# EasyEDA Pro project ProProject_工科大_2023-10-10.epro

# Schematic power
Create Date: 2023-09-30; Page Name: P1; Project Name: 工科大; Schematic Name: power; Update Date: 2023-10-10; Company: 嘉立创EDA; Page Size: A4; Version: V1.0
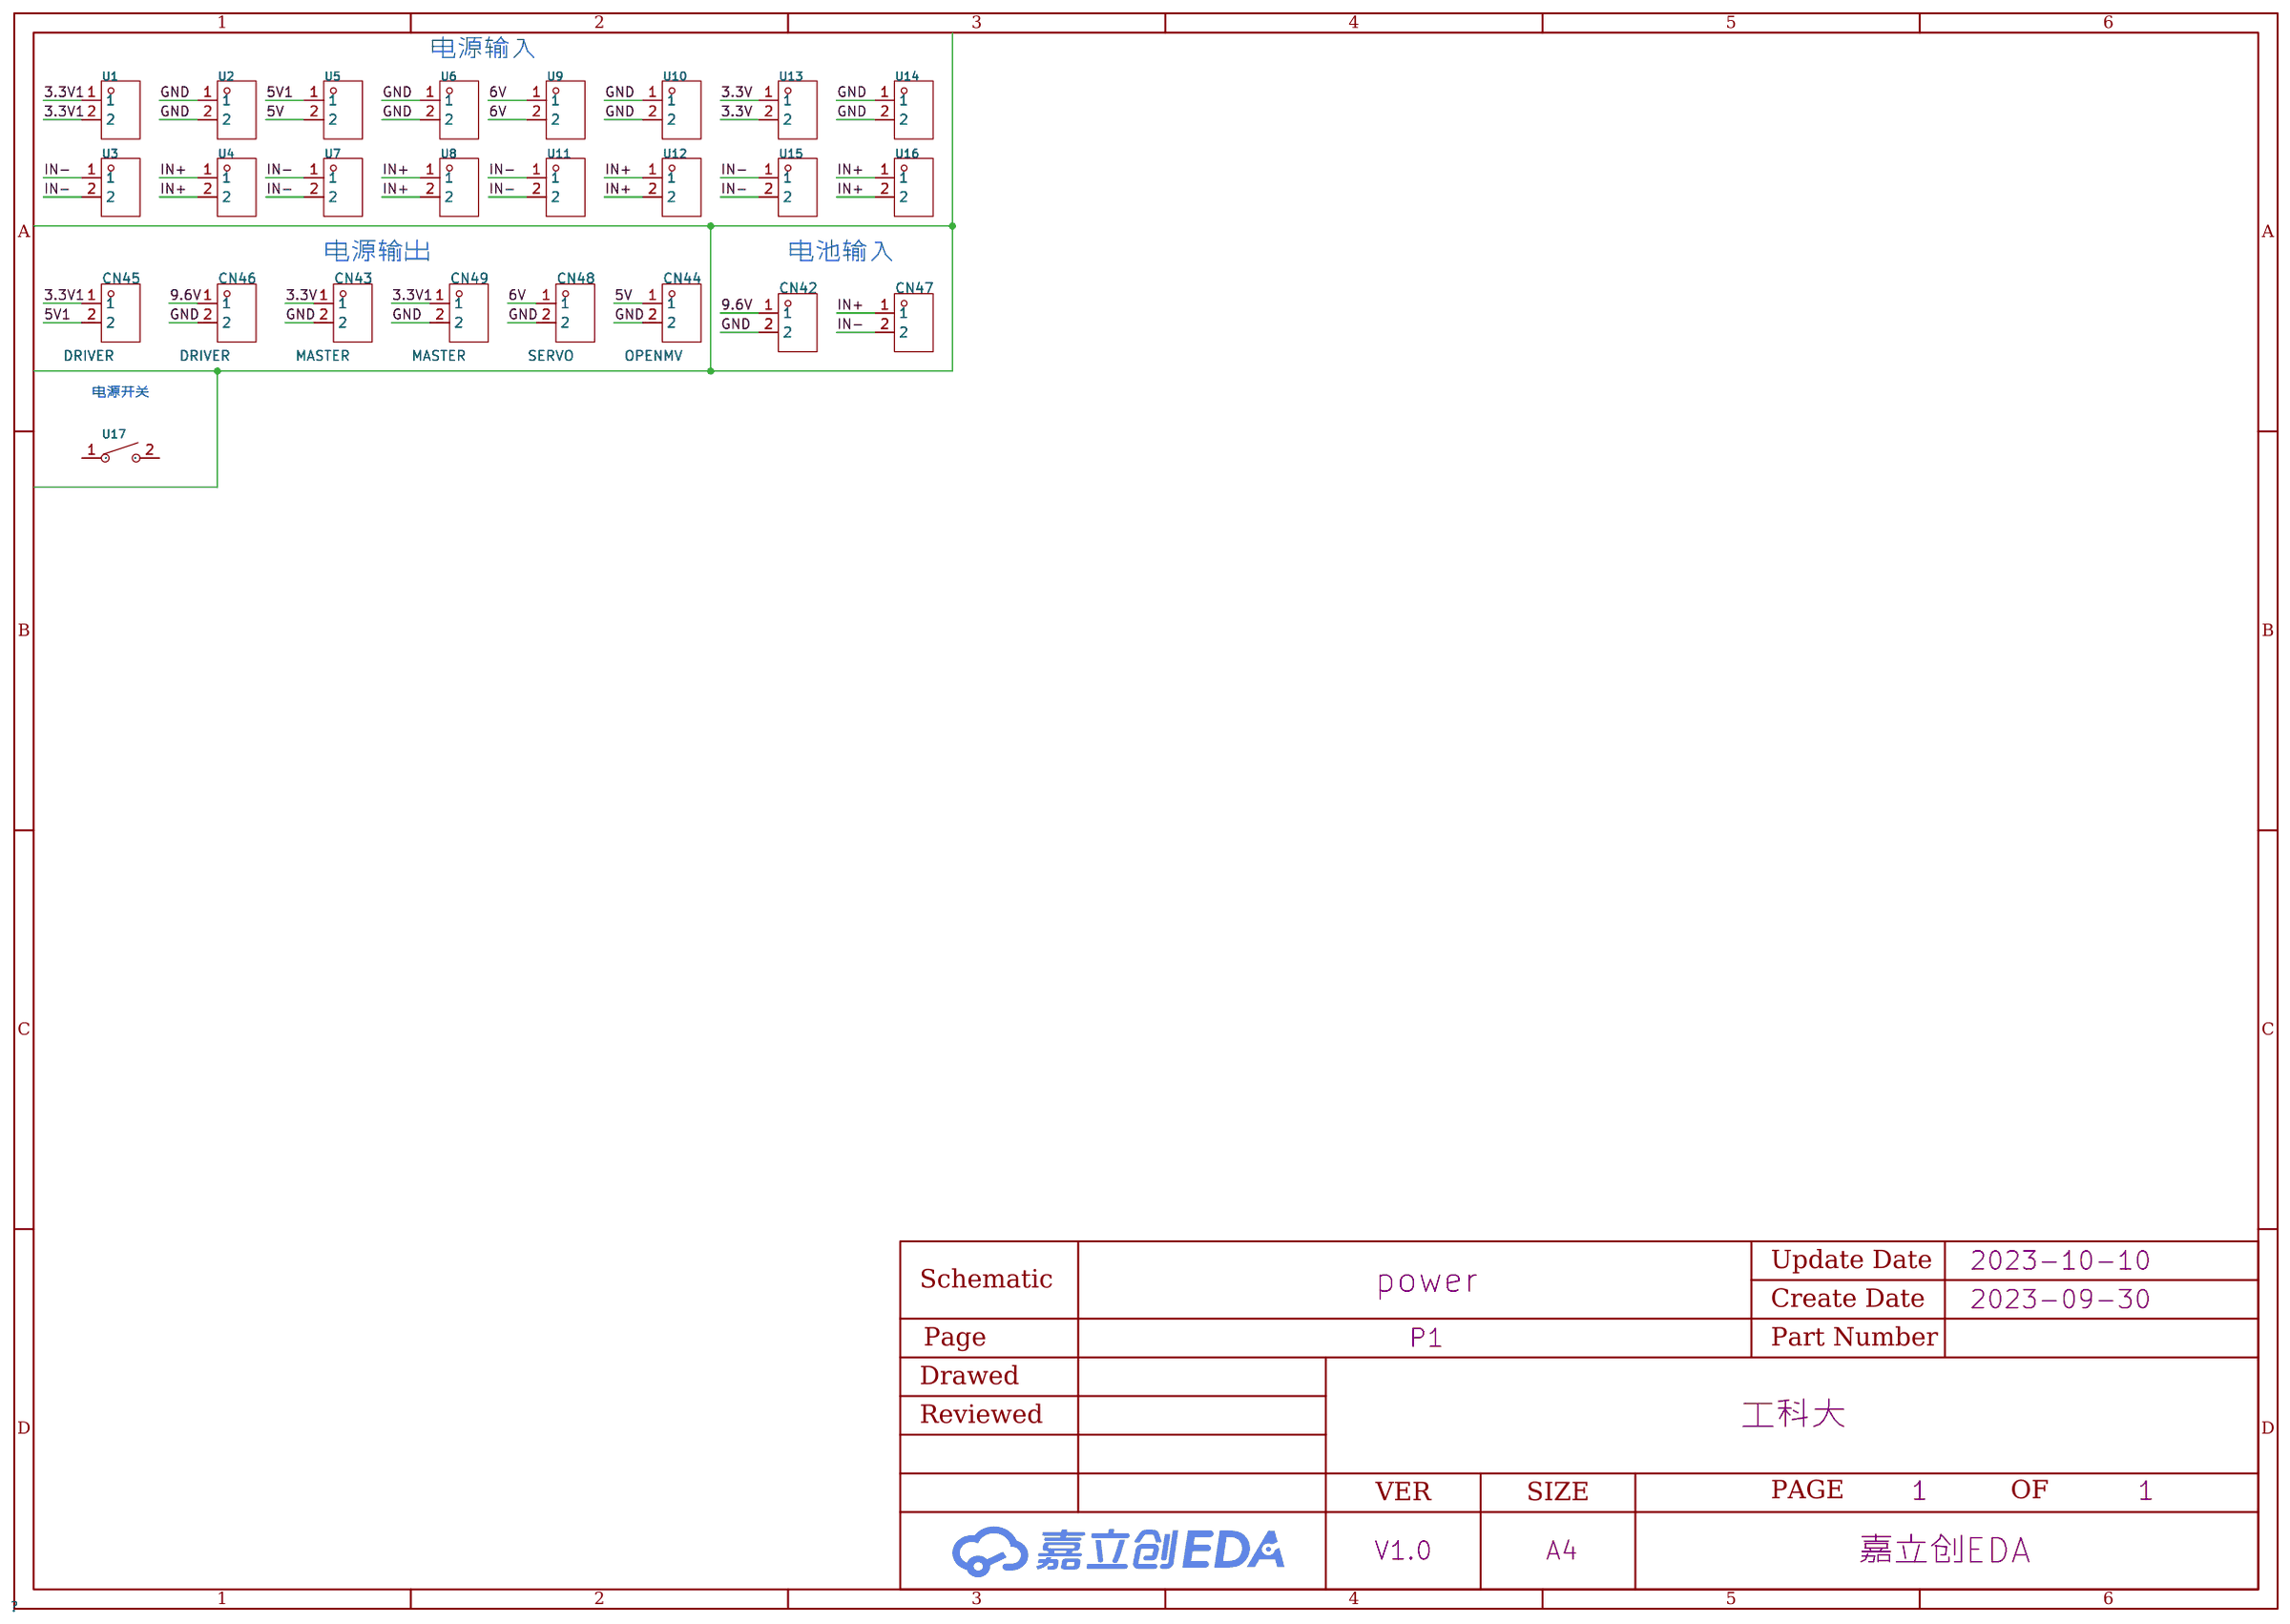
[diagram p0: schematic sheet]

## Parts
CN42  XH-2AW  [CONN-TH_XH-2AW_C2908611]
CN43  MASTER  [CONN-TH_XH-2AW_C2908611]
CN44  OPENMV  [CONN-TH_XH-2AW_C2908611]
CN45  DRIVER  [CONN-TH_XH-2AW_C2908611]
CN46  DRIVER  [CONN-TH_XH-2AW_C2908611]
CN47  XH-2AW  [CONN-TH_XH-2AW_C2908611]
CN48  SERVO  [CONN-TH_XH-2AW_C2908611]
CN49  MASTER  [CONN-TH_XH-2AW_C2908611]
U1  PM254-1-02-Z-8.5  [HDR-TH_2P-P2.54-V-F]
U2  PM254-1-02-Z-8.5  [HDR-TH_2P-P2.54-V-F]
U3  PM254-1-02-Z-8.5  [HDR-TH_2P-P2.54-V-F]
U4  PM254-1-02-Z-8.5  [HDR-TH_2P-P2.54-V-F]
U5  PM254-1-02-Z-8.5  [HDR-TH_2P-P2.54-V-F]
U6  PM254-1-02-Z-8.5  [HDR-TH_2P-P2.54-V-F]
U7  PM254-1-02-Z-8.5  [HDR-TH_2P-P2.54-V-F]
U8  PM254-1-02-Z-8.5  [HDR-TH_2P-P2.54-V-F]
U9  PM254-1-02-Z-8.5  [HDR-TH_2P-P2.54-V-F]
U10  PM254-1-02-Z-8.5  [HDR-TH_2P-P2.54-V-F]
U11  PM254-1-02-Z-8.5  [HDR-TH_2P-P2.54-V-F]
U12  PM254-1-02-Z-8.5  [HDR-TH_2P-P2.54-V-F]
U13  PM254-1-02-Z-8.5  [HDR-TH_2P-P2.54-V-F]
U14  PM254-1-02-Z-8.5  [HDR-TH_2P-P2.54-V-F]
U15  PM254-1-02-Z-8.5  [HDR-TH_2P-P2.54-V-F]
U16  PM254-1-02-Z-8.5  [HDR-TH_2P-P2.54-V-F]
U17  电源开关  [SW-TH_RS601A-1010013BB]

## Library data of the parts
CN42-CN49 = XH-2AW_C2908611: 参考系列:XH;间距:2.54mm;插针结构:1x2P;排数:1;每排PIN数:2;行距:-;公母:公型插针;安装方式:弯插;额定电流:3A;工作温度范围:-25℃~+85℃;; LCSC Part Name: XH 2.54mm 1x2P 弯插; Supplier Part: C2908611; Manufacturer: HCTL(华灿天禄); Supplier Footprint: 弯插,P=2.54mm; JLCPCB Part Class: 扩展库; Datasheet: https://atta.szlcsc.com/upload/public/pdf/source/20211021/ACA2D54D99493880102FCACAC8DAABA8.pdf; Supplier: LCSC; Reference Series: XH; Pitch: 2.54mm; Pins Structure: 1x2P; Number of Rows: 1; Number of PINs Per Row: 2; Gender: 公型插针; Mounting Style: 弯插; Current Rating (Max): 3A; Operating Temperature Range: -25℃~+85℃
U1-U16 = PM254-1-02-Z-8.5: 排数:单排;总孔位数:2P;间距:2.54mm;插孔结构:1x2P;行距:-;安装类型:直插;圆孔/方孔:方孔;额定电流:3A;额定电压:-;插孔方向:顶部;塑高:8.5mm;工作温度范围:-40℃~+105℃;; LCSC Part Name: 2.54mm 1x2P; Supplier Part: C2897365; Manufacturer: HCTL(华灿天禄); Supplier Footprint: 插件,P=2.54mm; JLCPCB Part Class: 扩展库; Datasheet: https://atta.szlcsc.com/upload/public/pdf/source/20230609/534BE42964C679BDE98E061007C4ABD6.pdf; Supplier: LCSC; Number of Rows: 单排; Number of Holes: 2P; Pitch: 2.54mm; Holes Structure: 1x2P; Mounting Type: 直插; Circular Hole / Square Hole: 方孔; Current Rating (Max): 3A; Holes Direction: 顶部; Insulation Height: 8.5mm; Operating Temperature Range: -40℃~+105℃
U17 = RS601A-1010013BB: 额定电流：6A 额定电压(AC)：250V 电路结构：单刀单掷 机械寿命：10000 翘板形状：凹面弯曲 翘板颜色：黑色 翘板标志：| O 带灯：无 引脚样式：焊片 工作温度：-25℃~+85℃ 开关长度：21mm 开关宽度：15mm 开关高度：13.6mm; LCSC Part Name: 弯脚船型开关; Supplier Part: C5124217; Manufacturer: HCTL(华灿天禄); Supplier Footprint: 插件; Datasheet: https://atta.szlcsc.com/upload/public/pdf/source/20230703/4B37802243C6D02ECBD985ACB2856989.pdf; Supplier: LCSC

## Nets
3.3V: CN43.1 U13.1 U13.2
3.3V1: CN45.1 CN49.1 U1.1 U1.2
5V: CN44.1 U5.2
5V1: CN45.2 U5.1
6V: CN48.1 U9.1 U9.2
9.6V: CN42.1 CN46.1
GND: CN42.2 CN43.2 CN44.2 CN46.2 CN48.2 CN49.2 U2.1 U2.2 U6.1 U6.2 U10.1 U10.2 U14.1 U14.2
IN+: CN47.1 U4.1 U4.2 U8.1 U8.2 U12.1 U12.2 U16.1 U16.2
IN-: CN47.2 U3.1 U3.2 U7.1 U7.2 U11.1 U11.2 U15.1 U15.2

Not connected (* = marked no-connect by the designer): U17 1 2

## Notes on the sheet
- 电源输入
- 电源输出
- 电池输入
- 电源开关

# Schematic driver
Create Date: 2023-09-30; Page Name: P1; Project Name: 工科大; Schematic Name: driver; Update Date: 2023-10-06; Company: 嘉立创EDA; Page Size: A4; Version: V1.0
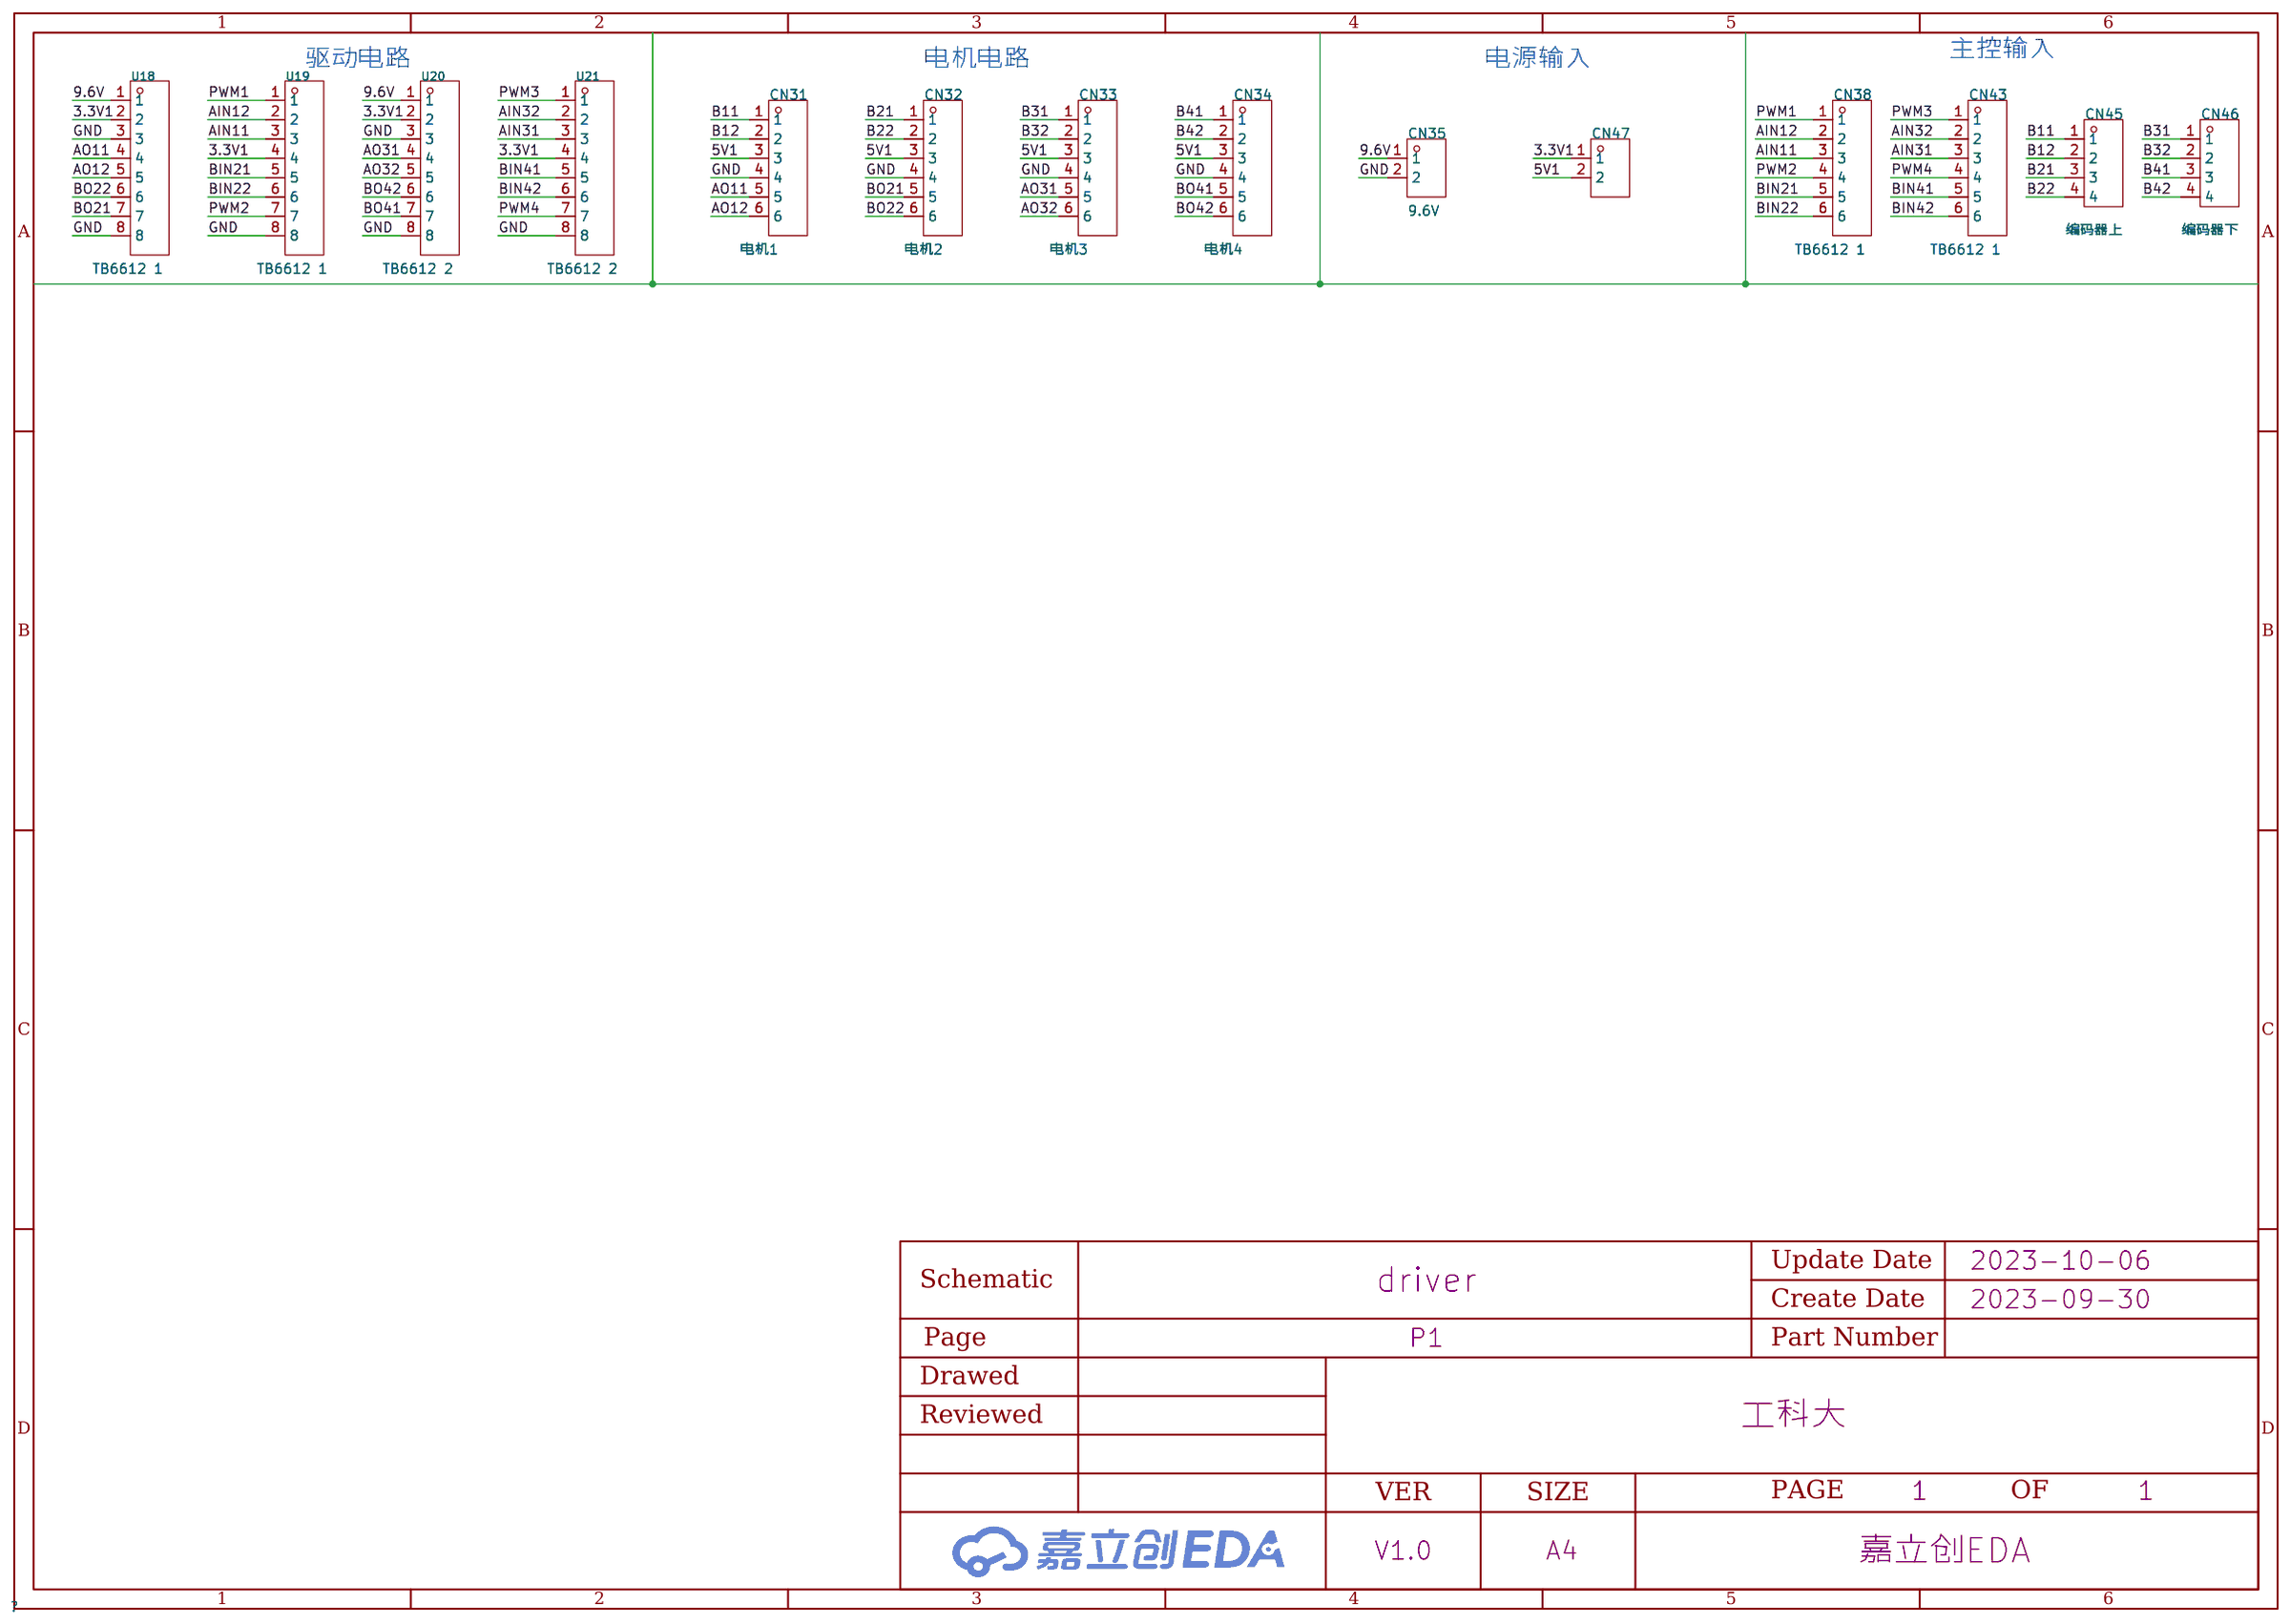
[diagram p1: schematic sheet]

## Parts
CN31  电机1  [CONN-TH_6P-P2.50_HC-XH-6AW-G]
CN32  电机2  [CONN-TH_6P-P2.50_HC-XH-6AW-G]
CN33  电机3  [CONN-TH_6P-P2.50_HC-XH-6AW-G]
CN34  电机4  [CONN-TH_6P-P2.50_HC-XH-6AW-G]
CN35  9.6V  [CONN-TH_XH-2AW_C2908611]
CN38  TB6612 1  [CONN-TH_6P-P2.50_HC-XH-6AW-G]
CN43  TB6612 1  [CONN-TH_6P-P2.50_HC-XH-6AW-G]
CN45  编码器上  [CONN-TH_XH-4AW]
CN46  编码器下  [CONN-TH_XH-4AW]
CN47  XH-2AW  [CONN-TH_XH-2AW_C2908611]
U18  TB6612 1  [HDR-TH_8P-P2.54-V-F]
U19  TB6612 1  [HDR-TH_8P-P2.54-V-F]
U20  TB6612 2  [HDR-TH_8P-P2.54-V-F]
U21  TB6612 2  [HDR-TH_8P-P2.54-V-F]

## Library data of the parts
CN31-CN34 CN38 CN43 = HC-XH-6AW-G: 参考系列:XH;间距:2.54mm;插针结构:1x6P;排数:1;每排PIN数:6;行距:2.54mm;公母:公型插针;安装方式:弯插;额定电流:3A;工作温度范围:-25℃~+85℃;; LCSC Part Name: XH 2.54mm 1x6P 弯插; Supplier Part: C5341212; Manufacturer: HCTL(华灿天禄); Supplier Footprint: 弯插,P=2.5mm; JLCPCB Part Class: 扩展库; Datasheet: https://atta.szlcsc.com/upload/public/pdf/source/20230105/4FFD2EFD3DA44AA828171A44400F3EDE.pdf; Supplier: LCSC; Reference Series: XH; Pitch: 2.54mm; Pins Structure: 1x6P; Number of Rows: 1; Number of PINs Per Row: 6; Row Spacing: 2.54mm; Gender: 公型插针; Mounting Style: 弯插; Current Rating (Max): 3A; Operating Temperature Range: -25℃~+85℃
CN35 CN47 = XH-2AW_C2908611: 参考系列:XH;间距:2.54mm;插针结构:1x2P;排数:1;每排PIN数:2;行距:-;公母:公型插针;安装方式:弯插;额定电流:3A;工作温度范围:-25℃~+85℃;; LCSC Part Name: XH 2.54mm 1x2P 弯插; Supplier Part: C2908611; Manufacturer: HCTL(华灿天禄); Supplier Footprint: 弯插,P=2.54mm; JLCPCB Part Class: 扩展库; Datasheet: https://atta.szlcsc.com/upload/public/pdf/source/20211021/ACA2D54D99493880102FCACAC8DAABA8.pdf; Supplier: LCSC; Reference Series: XH; Pitch: 2.54mm; Pins Structure: 1x2P; Number of Rows: 1; Number of PINs Per Row: 2; Gender: 公型插针; Mounting Style: 弯插; Current Rating (Max): 3A; Operating Temperature Range: -25℃~+85℃
CN45 CN46 = XH-4AW: 参考系列:XH;间距:2.54mm;插针结构:1x4P;排数:1;每排PIN数:4;行距:-;公母:公型插针;安装方式:弯插;额定电流:3A;工作温度范围:-25℃~+85℃;; LCSC Part Name: XH 2.54mm 1x4P 弯插; Supplier Part: C2908613; Manufacturer: HCTL(华灿天禄); Supplier Footprint: 插件,P=2.54mm; JLCPCB Part Class: 扩展库; Datasheet: https://atta.szlcsc.com/upload/public/pdf/source/20211021/ACA2D54D99493880102FCACAC8DAABA8.pdf; Supplier: LCSC; Reference Series: XH; Pitch: 2.54mm; Pins Structure: 1x4P; Number of Rows: 1; Number of PINs Per Row: 4; Gender: 公型插针; Mounting Style: 弯插; Current Rating (Max): 3A; Operating Temperature Range: -25℃~+85℃
U18-U21 = PM254-1-08-Z-8.5: 排数:单排;总孔位数:8P;间距:2.54mm;插孔结构:1x8P;行距:-;安装类型:直插;圆孔/方孔:方孔;额定电流:3A;额定电压:-;插孔方向:顶部;塑高:8.5mm;工作温度范围:-40℃~+105℃;; LCSC Part Name: 2.54mm 1x8P; Supplier Part: C2897371; Manufacturer: HCTL(华灿天禄); Supplier Footprint: 插件,P=2.54mm; JLCPCB Part Class: 扩展库; Datasheet: https://atta.szlcsc.com/upload/public/pdf/source/20230609/534BE42964C679BDE98E061007C4ABD6.pdf; Supplier: LCSC; Number of Rows: 单排; Number of Holes: 8P; Pitch: 2.54mm; Holes Structure: 1x8P; Mounting Type: 直插; Circular Hole / Square Hole: 方孔; Current Rating (Max): 3A; Holes Direction: 顶部; Insulation Height: 8.5mm; Operating Temperature Range: -40℃~+105℃

## Nets
3.3V1: CN47.1 U18.2 U19.4 U20.2 U21.4
5V1: CN31.3 CN32.3 CN33.3 CN34.3 CN47.2
9.6V: CN35.1 U18.1 U20.1
GND: CN31.4 CN32.4 CN33.4 CN34.4 CN35.2 U18.3 U18.8 U19.8 U20.3 U20.8 U21.8
AIN11: CN38.3 U19.3
AIN12: CN38.2 U19.2
AIN31: CN43.3 U21.3
AIN32: CN43.2 U21.2
AO11: CN31.5 U18.4
AO12: CN31.6 U18.5
AO31: CN33.5 U20.4
AO32: CN33.6 U20.5
B11: CN31.1 CN45.1
B12: CN31.2 CN45.2
B21: CN32.1 CN45.3
B22: CN32.2 CN45.4
B31: CN33.1 CN46.1
B32: CN33.2 CN46.2
B41: CN34.1 CN46.3
B42: CN34.2 CN46.4
BIN21: CN38.5 U19.5
BIN22: CN38.6 U19.6
BIN41: CN43.5 U21.5
BIN42: CN43.6 U21.6
BO21: CN32.5 U18.7
BO22: CN32.6 U18.6
BO41: CN34.5 U20.7
BO42: CN34.6 U20.6
PWM1: CN38.1 U19.1
PWM2: CN38.4 U19.7
PWM3: CN43.1 U21.1
PWM4: CN43.4 U21.7

## Notes on the sheet
- 主控输入
- 驱动电路
- 电机电路
- 电源输入

# Schematic master control
Create Date: 2023-09-30; Page Name: P1; Project Name: 工科大; Schematic Name: master control; Update Date: 2023-10-10; Company: 嘉立创EDA; Page Size: A4; Version: V1.0
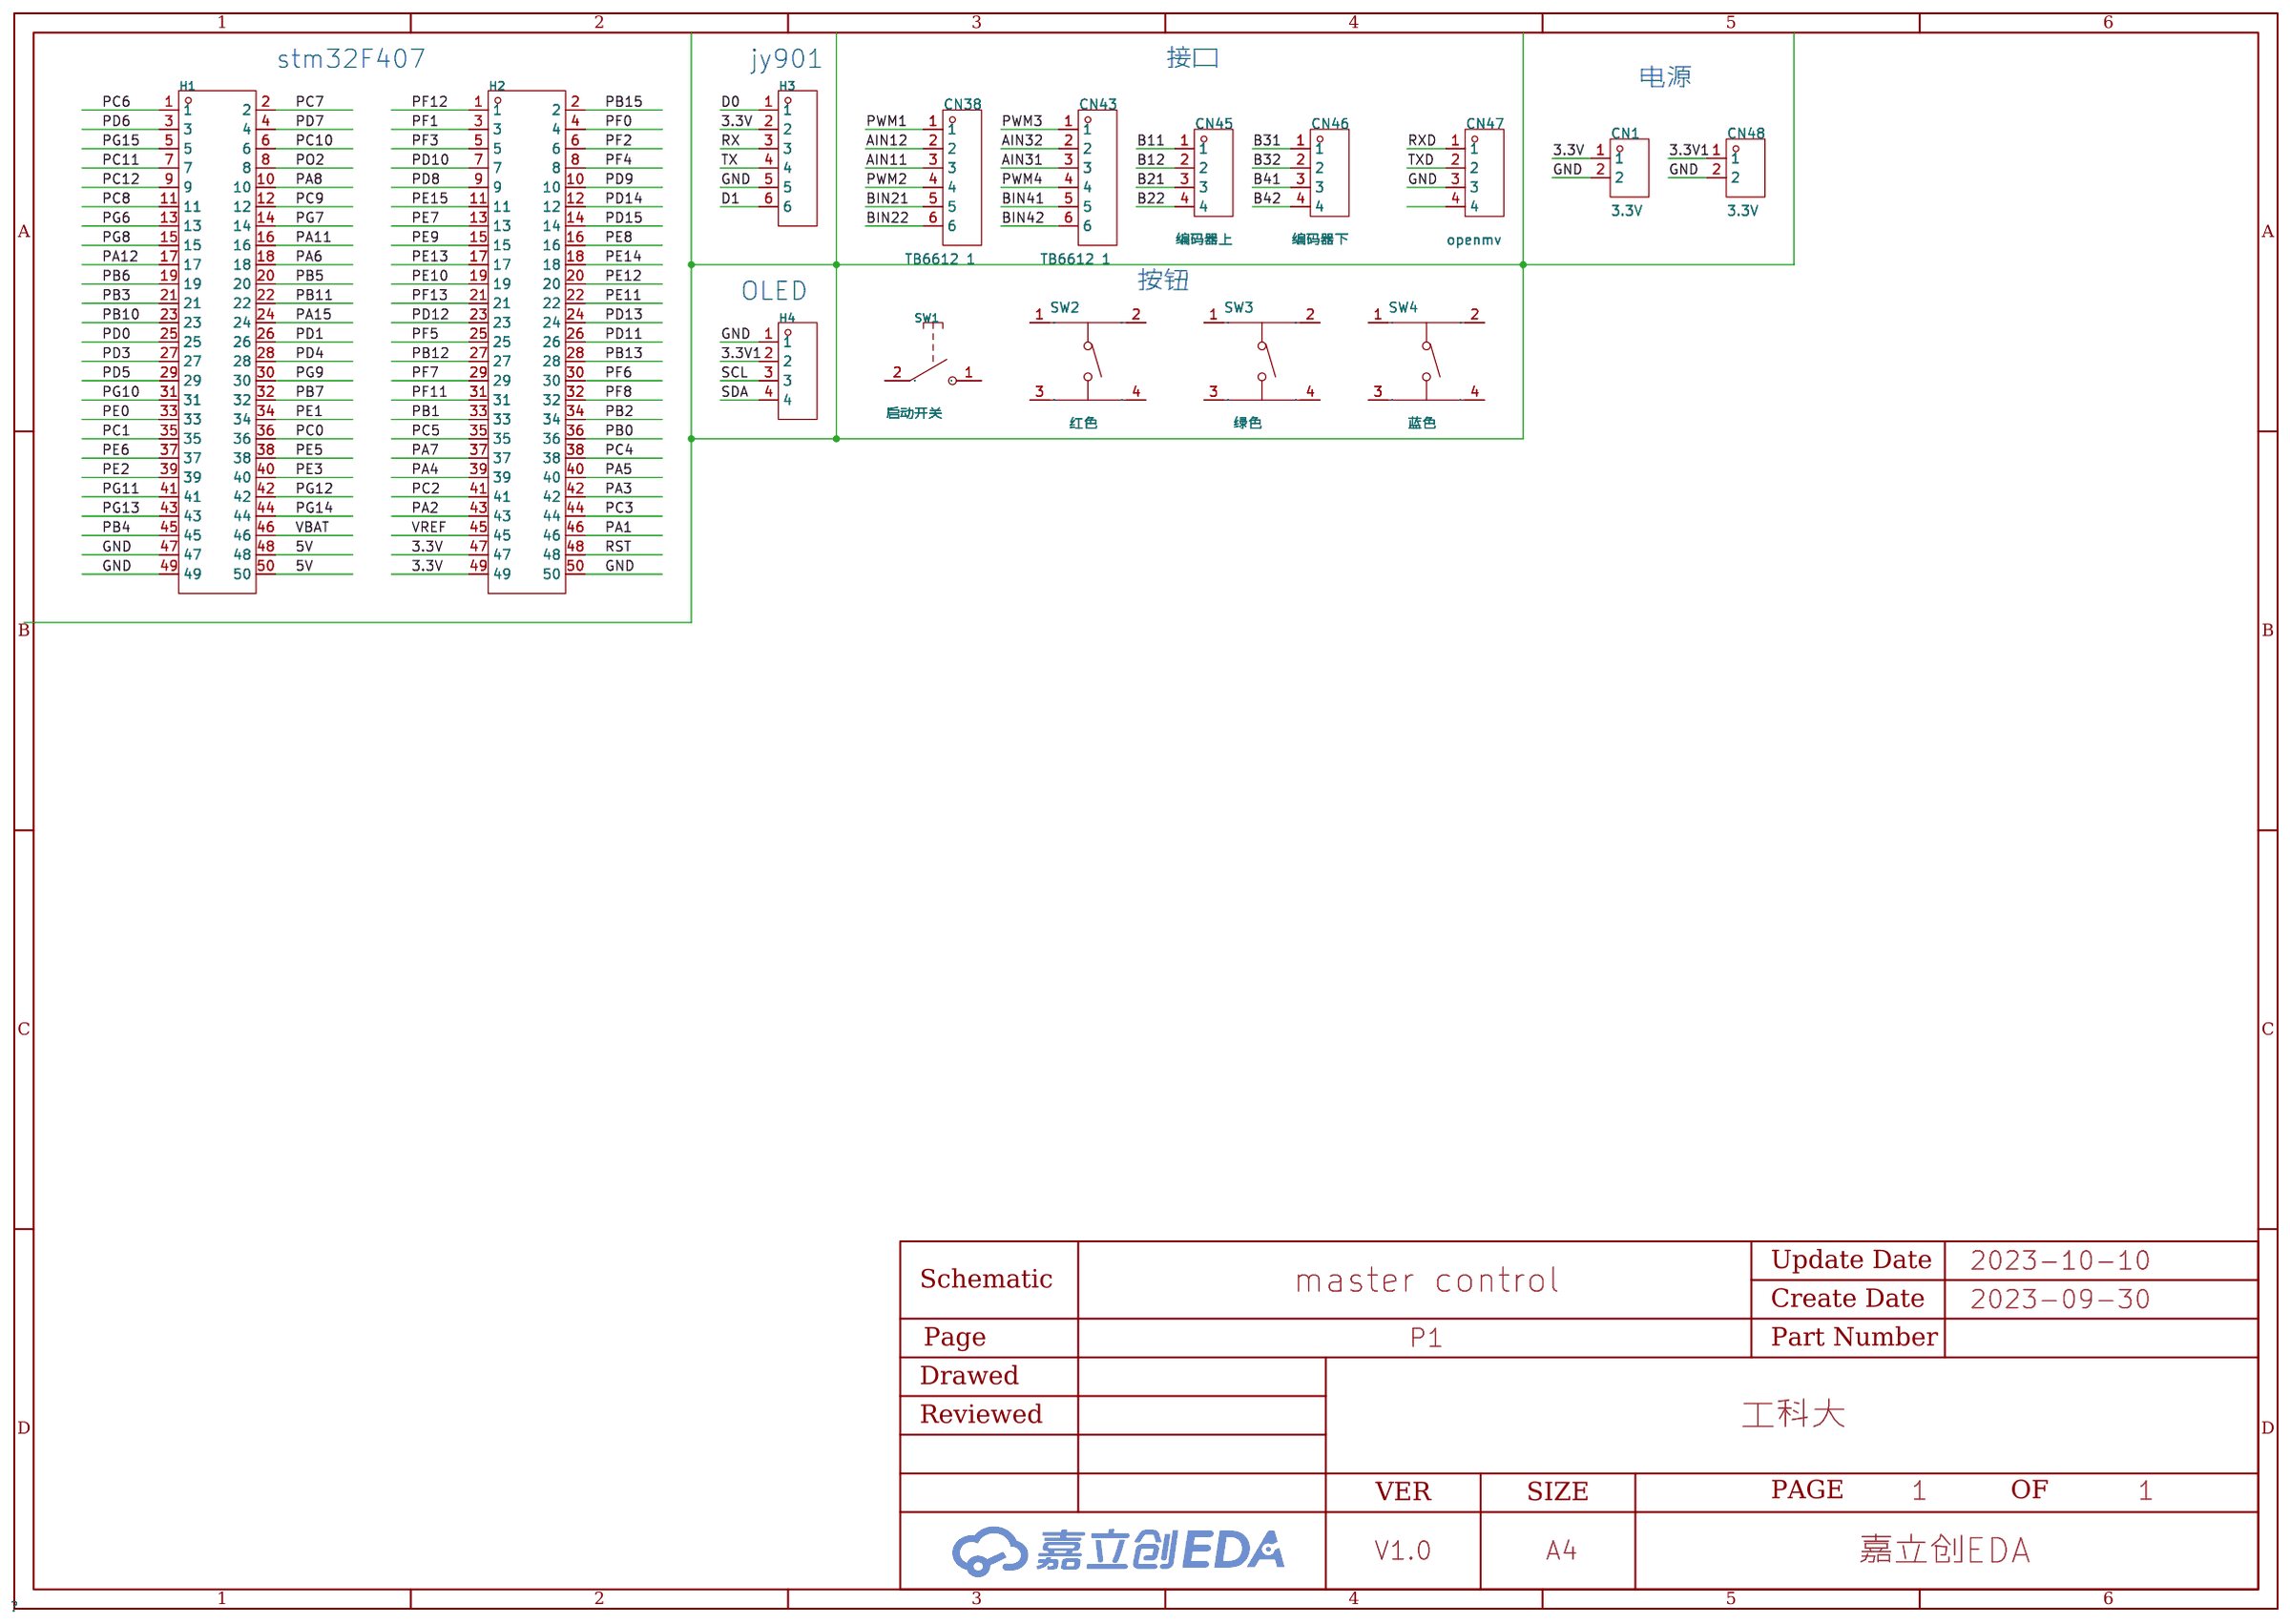
[diagram p2: schematic sheet]

## Parts
CN1  3.3V  [CONN-TH_XH-2AW_C2908611]
CN38  TB6612 1  [CONN-TH_6P-P2.50_HC-XH-6AW-G]
CN43  TB6612 1  [CONN-TH_6P-P2.50_HC-XH-6AW-G]
CN45  编码器上  [CONN-TH_XH-4AW]
CN46  编码器下  [CONN-TH_XH-4AW]
CN47  openmv  [CONN-TH_XH-4AW]
CN48  3.3V  [CONN-TH_XH-2AW_C2908611]
H1  FH-00077  [HDR-TH_50P-P2.54-V-F-R2-C25-S2.54-1]
H2  FH-00077  [HDR-TH_50P-P2.54-V-F-R2-C25-S2.54-1]
H3  PM254V-11-06-H85  [HDR-TH_6P-P2.54-V-F]
H4  PM254V-11-04-H85  [HDR-TH_4P-P2.54-V-F]
SW1  启动开关  [SW-TH_RS601A-1010015BB]
SW2  红色  [SW-TH_4P-L6.0-W6.0-P4.50-LS6.5]
SW3  绿色  [SW-TH_4P-L6.0-W6.0-P4.50-LS6.5]
SW4  蓝色  [SW-TH_4P-L6.0-W6.0-P4.50-LS6.5]

## Library data of the parts
CN1 CN48 = XH-2AW_C2908611: 参考系列:XH;间距:2.54mm;插针结构:1x2P;排数:1;每排PIN数:2;行距:-;公母:公型插针;安装方式:弯插;额定电流:3A;工作温度范围:-25℃~+85℃;; LCSC Part Name: XH 2.54mm 1x2P 弯插; Supplier Part: C2908611; Manufacturer: HCTL(华灿天禄); Supplier Footprint: 弯插,P=2.54mm; JLCPCB Part Class: 扩展库; Datasheet: https://atta.szlcsc.com/upload/public/pdf/source/20211021/ACA2D54D99493880102FCACAC8DAABA8.pdf; Supplier: LCSC; Reference Series: XH; Pitch: 2.54mm; Pins Structure: 1x2P; Number of Rows: 1; Number of PINs Per Row: 2; Gender: 公型插针; Mounting Style: 弯插; Current Rating (Max): 3A; Operating Temperature Range: -25℃~+85℃
CN38 CN43 = HC-XH-6AW-G: 参考系列:XH;间距:2.54mm;插针结构:1x6P;排数:1;每排PIN数:6;行距:2.54mm;公母:公型插针;安装方式:弯插;额定电流:3A;工作温度范围:-25℃~+85℃;; LCSC Part Name: XH 2.54mm 1x6P 弯插; Supplier Part: C5341212; Manufacturer: HCTL(华灿天禄); Supplier Footprint: 弯插,P=2.5mm; JLCPCB Part Class: 扩展库; Datasheet: https://atta.szlcsc.com/upload/public/pdf/source/20230105/4FFD2EFD3DA44AA828171A44400F3EDE.pdf; Supplier: LCSC; Reference Series: XH; Pitch: 2.54mm; Pins Structure: 1x6P; Number of Rows: 1; Number of PINs Per Row: 6; Row Spacing: 2.54mm; Gender: 公型插针; Mounting Style: 弯插; Current Rating (Max): 3A; Operating Temperature Range: -25℃~+85℃
CN45-CN47 = XH-4AW: 参考系列:XH;间距:2.54mm;插针结构:1x4P;排数:1;每排PIN数:4;行距:-;公母:公型插针;安装方式:弯插;额定电流:3A;工作温度范围:-25℃~+85℃;; LCSC Part Name: XH 2.54mm 1x4P 弯插; Supplier Part: C2908613; Manufacturer: HCTL(华灿天禄); Supplier Footprint: 插件,P=2.54mm; JLCPCB Part Class: 扩展库; Datasheet: https://atta.szlcsc.com/upload/public/pdf/source/20211021/ACA2D54D99493880102FCACAC8DAABA8.pdf; Supplier: LCSC; Reference Series: XH; Pitch: 2.54mm; Pins Structure: 1x4P; Number of Rows: 1; Number of PINs Per Row: 4; Gender: 公型插针; Mounting Style: 弯插; Current Rating (Max): 3A; Operating Temperature Range: -25℃~+85℃
H1 H2 = FH-00077: 排数:双排;总孔位数:50;间距:2.54mm;插孔结构:2x25P;行距:2.54mm;安装类型:直插;圆孔/方孔:方孔;额定电流:3A;额定电压:-;插孔方向:顶部;塑高:8.5mm;触头材质:黄铜;触头镀层:金;工作温度范围:-40℃~+105℃;焊接温度(最大值):200℃@10S;; LCSC Part Name: 2.54mm 2x25P; Supplier Part: C2829906; Manufacturer: Liansheng(连盛); Supplier Footprint: 直插,P=2.54mm; JLCPCB Part Class: 扩展库; Supplier: LCSC; Number of Rows: 双排; Number of Holes: 50; Pitch: 2.54mm; Holes Structure: 2x25P; Row Spacing: 2.54mm; Mounting Type: 直插; Circular Hole / Square Hole: 方孔; Current Rating (Max): 3A; Holes Direction: 顶部; Insulation Height: 8.5mm; Contact Material: 黄铜; Contact Plating: 金; Operating Temperature Range: -40℃~+105℃; Welding Temperature (Max): 200℃@10S
H3 = PM254V-11-06-H85: 排数:单排;总孔位数:6P;间距:2.54mm;插孔结构:1x6P;行距:-;安装类型:直插;圆孔/方孔:方孔;额定电流:3A;额定电压:250V;插孔方向:顶部;塑高:-;工作温度范围:-40℃~+105℃;; LCSC Part Name: 2.54mm 1x6P; Supplier Part: C2832269; Manufacturer: XFCN(兴飞); Supplier Footprint: 插件,P=2.54mm; JLCPCB Part Class: 扩展库; Datasheet: https://atta.szlcsc.com/upload/public/pdf/source/20210514/C2832269_B3EC97736B37C2783BDCE3050AA57447.pdf; Supplier: LCSC; Number of Rows: 单排; Number of Holes: 6P; Pitch: 2.54mm; Holes Structure: 1x6P; Mounting Type: 直插; Circular Hole / Square Hole: 方孔; Current Rating (Max): 3A; Voltage Rating (Max): 250V; Holes Direction: 顶部; Operating Temperature Range: -40℃~+105℃
H4 = PM254V-11-04-H85: 排数:单排;总孔位数:4;间距:2.54mm;插孔结构:1x4P;行距:-;安装类型:直插;塑高:-;触头材质:黄铜;触头镀层:-;; LCSC Part Name: 2.54mm 1x4P; Supplier Part: C541851; Manufacturer: XFCN(兴飞); Supplier Footprint: 直插,P=2.54mm; Supplier: LCSC; Number of Rows: 单排; Number of Holes: 4; Pitch: 2.54mm; Holes Structure: 1x4P; Mounting Type: 直插; Contact Material: 黄铜
SW1 = RS601A-1010015BB: 额定电流:8A;额定电压(AC):250V;额定电压(DC):-;电路结构:单刀单掷;机械寿命:1万次;带灯:无;引脚样式:焊片;; Supplier Part: C2885781; Manufacturer: HCTL(华灿天禄); Supplier Footprint: 插件; Datasheet: https://atta.szlcsc.com/upload/public/pdf/source/20210820/9642DA421E72F5CECD351F31F9652C32.pdf; Supplier: LCSC; Contact Current: 8A; Voltage Rating (AC): 250V; Circuit: 单刀单掷; Mechanical Life: 1万次; Actuator Type: 凹面弯曲; Actuator Color: 黑色; Actuator Marking: | O; With Lamp: 无; Pin Style: 焊片; Operating Temperature: -25℃~+85℃; Switch Length: 21mm; Switch Width: 15mm; Switch Height: 13.6mm
SW2-SW4 = TS-1095-A5B2-D1: 电路结构:单刀单掷;安装方式:直插;作用力:180gf@±30gf;机械寿命:-;带支架:否;; LCSC Part Name: 6*6*6mm 直插 轻触开关; Supplier Part: C782808; Manufacturer: Yuandi(元迪); Supplier Footprint: 插件; JLCPCB Part Class: 扩展库; Datasheet: https://atta.szlcsc.com/upload/public/pdf/source/20200908/C782804_D14F61DCCBE05C7EE913124CF28857B3.pdf; Supplier: LCSC; Circuit: 单刀单掷; Mounting Style: 直插; Actuator Style: 圆形按钮; Actuator/Cap Color: 黑色; Operating Force: 180gf@±30gf; Pin Style: PC引脚; Switch Length: 6mm; Switch Width: 6mm; Switch Height: 6mm; Strike Gundam: 否

## Nets
3.3V: CN1.1 H2.47 H2.49 H3.2
3.3V1: CN48.1 H4.2
5V: H1.48 H1.50
GND: CN1.2 CN47.3 CN48.2 H1.47 H1.49 H2.50 H3.5 H4.1
VBAT: H1.46
AIN11: CN38.3
AIN12: CN38.2
AIN31: CN43.3
AIN32: CN43.2
B11: CN45.1
B12: CN45.2
B21: CN45.3
B22: CN45.4
B31: CN46.1
B32: CN46.2
B41: CN46.3
B42: CN46.4
BIN21: CN38.5
BIN22: CN38.6
BIN41: CN43.5
BIN42: CN43.6
D0: H3.1
D1: H3.6
PA1: H2.46
PA2: H2.43
PA3: H2.42
PA4: H2.39
PA5: H2.40
PA6: H1.18
PA7: H2.37
PA8: H1.10
PA11: H1.16
PA12: H1.17
PA15: H1.24
PB0: H2.36
PB1: H2.33
PB2: H2.34
PB3: H1.21
PB4: H1.45
PB5: H1.20
PB6: H1.19
PB7: H1.32
PB10: H1.23
PB11: H1.22
PB12: H2.27
PB13: H2.28
PB15: H2.2
PC0: H1.36
PC1: H1.35
PC2: H2.41
PC3: H2.44
PC4: H2.38
PC5: H2.35
PC6: H1.1
PC7: H1.2
PC8: H1.11
PC9: H1.12
PC10: H1.6
PC11: H1.7
PC12: H1.9
PD0: H1.25
PD1: H1.26
PD3: H1.27
PD4: H1.28
PD5: H1.29
PD6: H1.3
PD7: H1.4
PD8: H2.9
PD9: H2.10
PD10: H2.7
PD11: H2.26
PD12: H2.23
PD13: H2.24
PD14: H2.12
PD15: H2.14
PE0: H1.33
PE1: H1.34
PE2: H1.39
PE3: H1.40
PE5: H1.38
PE6: H1.37
PE7: H2.13
PE8: H2.16
PE9: H2.15
PE10: H2.19
PE11: H2.22
PE12: H2.20
PE13: H2.17
PE14: H2.18
PE15: H2.11
PF0: H2.4
PF1: H2.3
PF2: H2.6
PF3: H2.5
PF4: H2.8
PF5: H2.25
PF6: H2.30
PF7: H2.29
PF8: H2.32
PF11: H2.31
PF12: H2.1
PF13: H2.21
PG6: H1.13
PG7: H1.14
PG8: H1.15
PG9: H1.30
PG10: H1.31
PG11: H1.41
PG12: H1.42
PG13: H1.43
PG14: H1.44
PG15: H1.5
PO2: H1.8
PWM1: CN38.1
PWM2: CN38.4
PWM3: CN43.1
PWM4: CN43.4
RST: H2.48
RX: H3.3
RXD: CN47.1
SCL: H4.3
SDA: H4.4
TX: H3.4
TXD: CN47.2
VREF: H2.45

Not connected (* = marked no-connect by the designer): CN47 4; SW1 1 2; SW2 1 2 3 4; SW3 1 2 3 4; SW4 1 2 3 4

## Notes on the sheet
- stm32F407
- jy901
- 接口
- 电源
- 按钮
- OLED

# Board master control
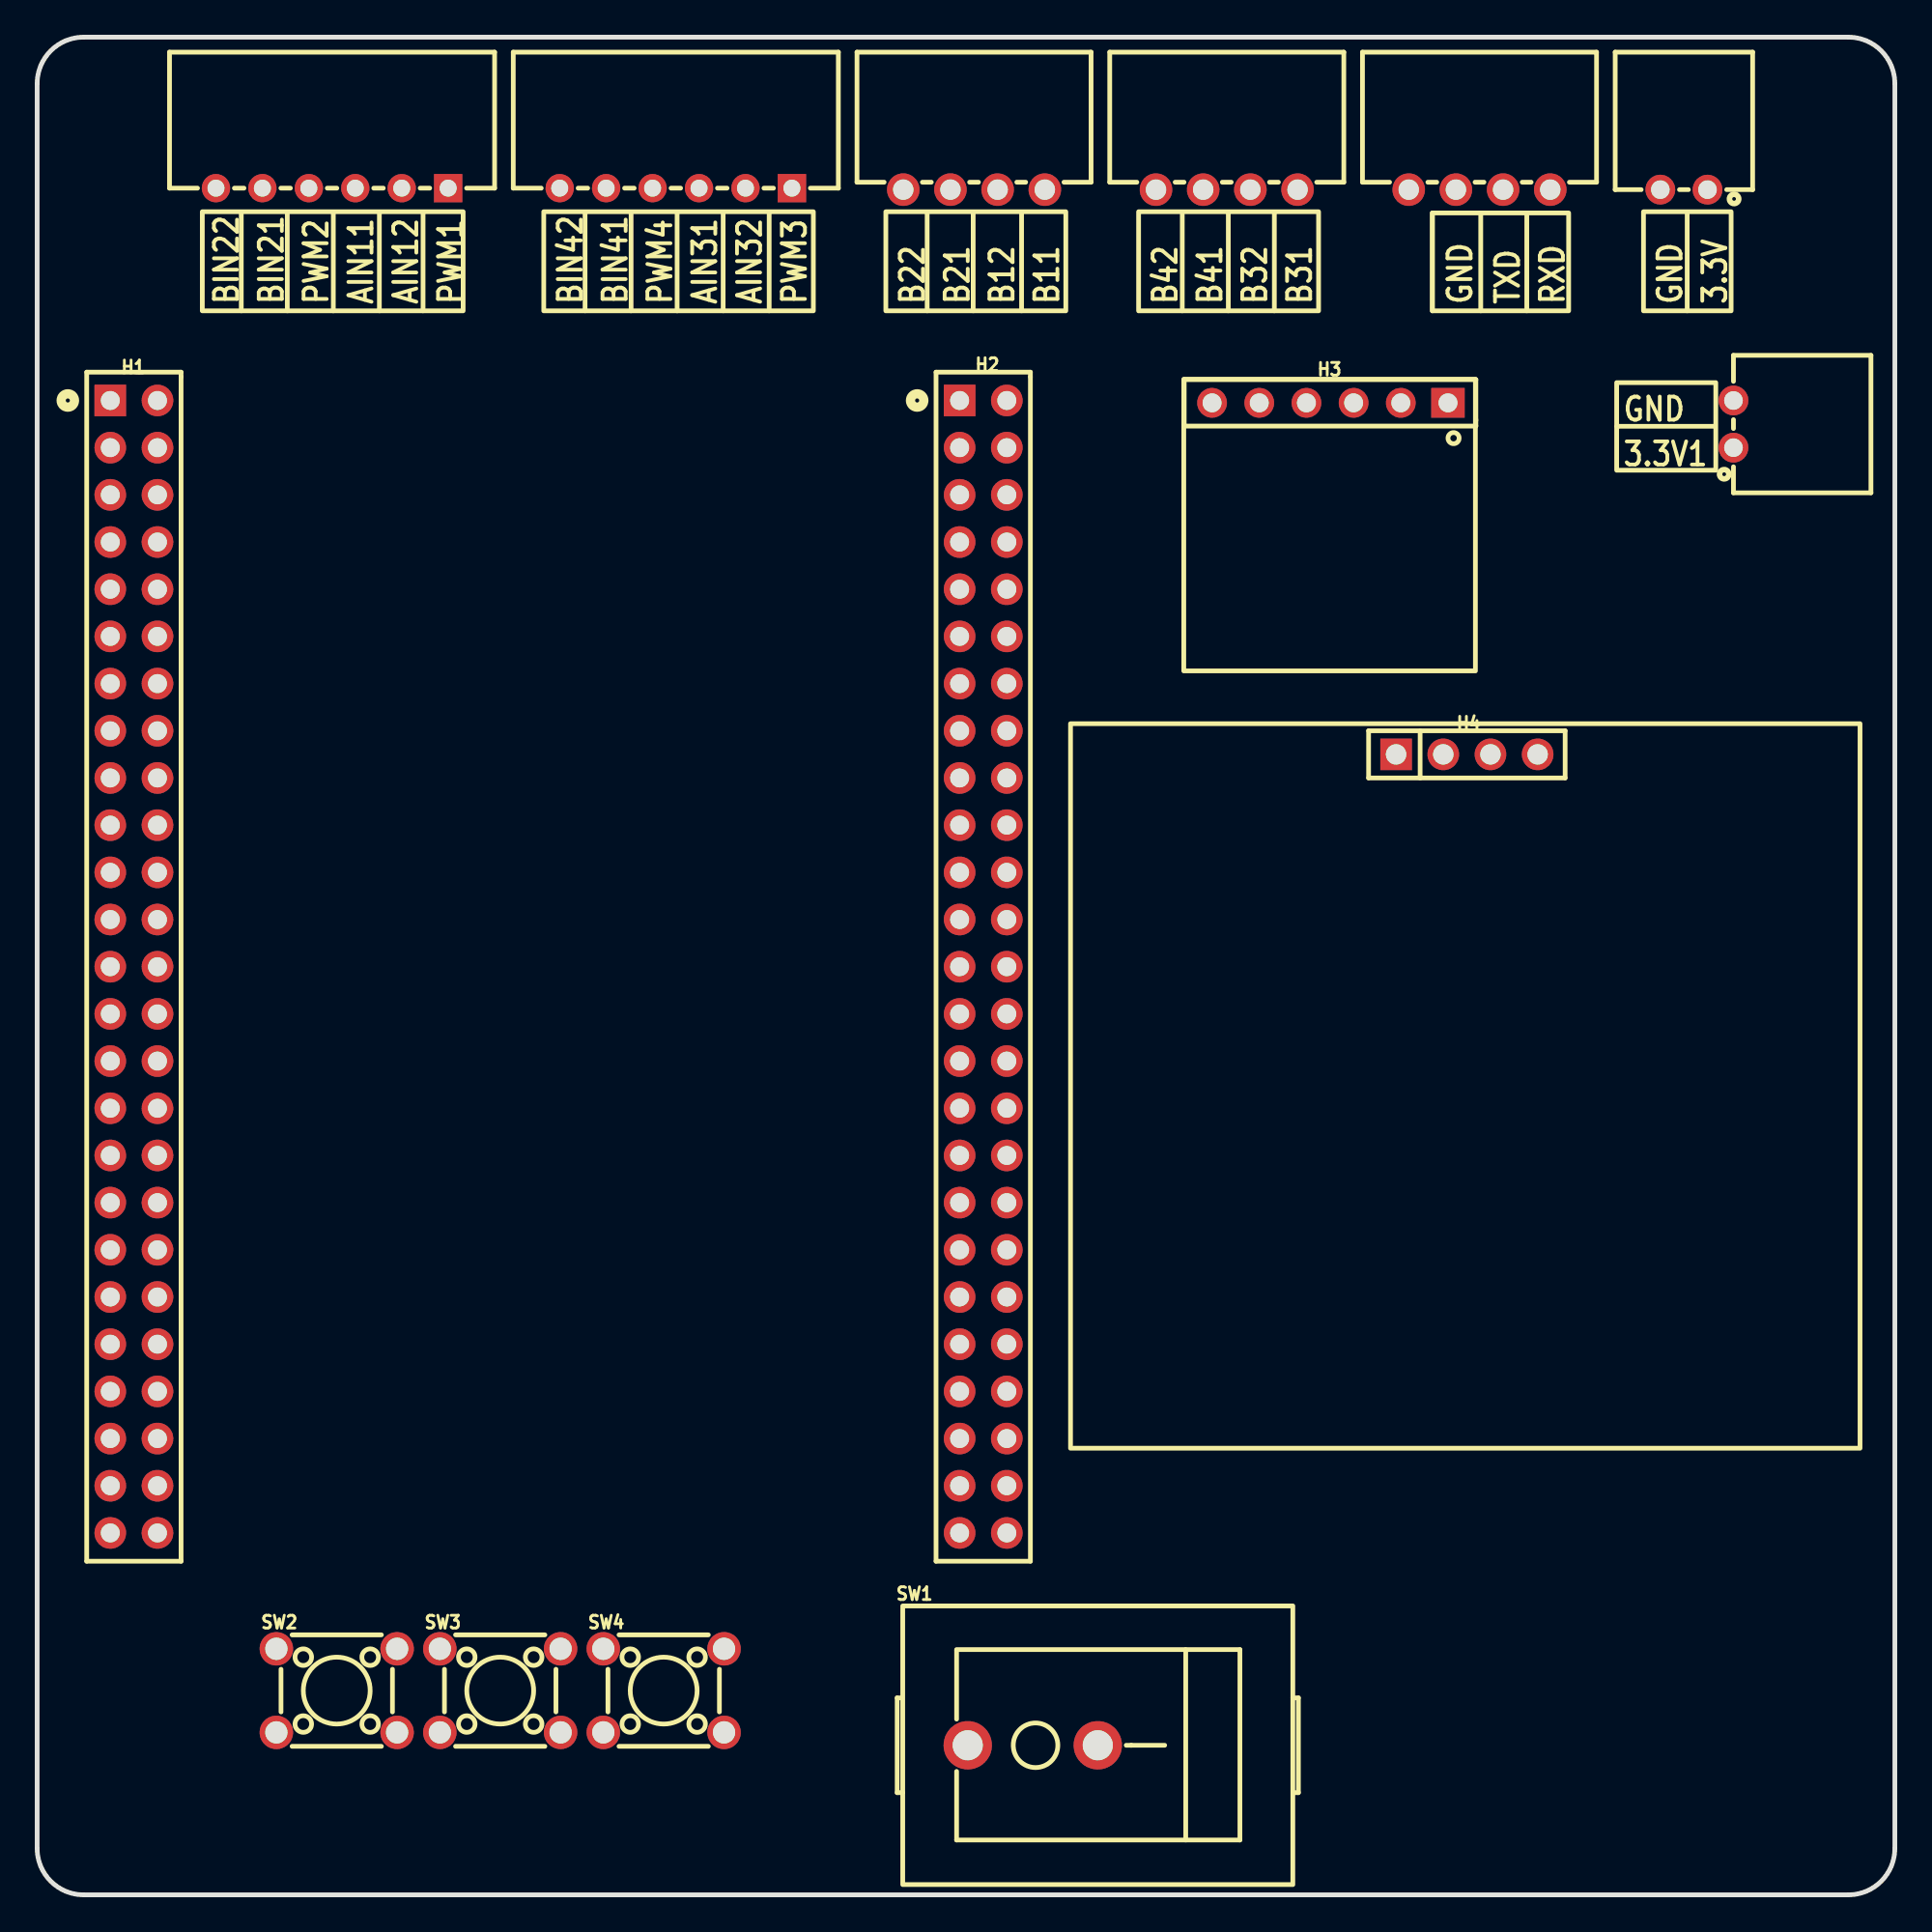
[diagram p3: board, top side]
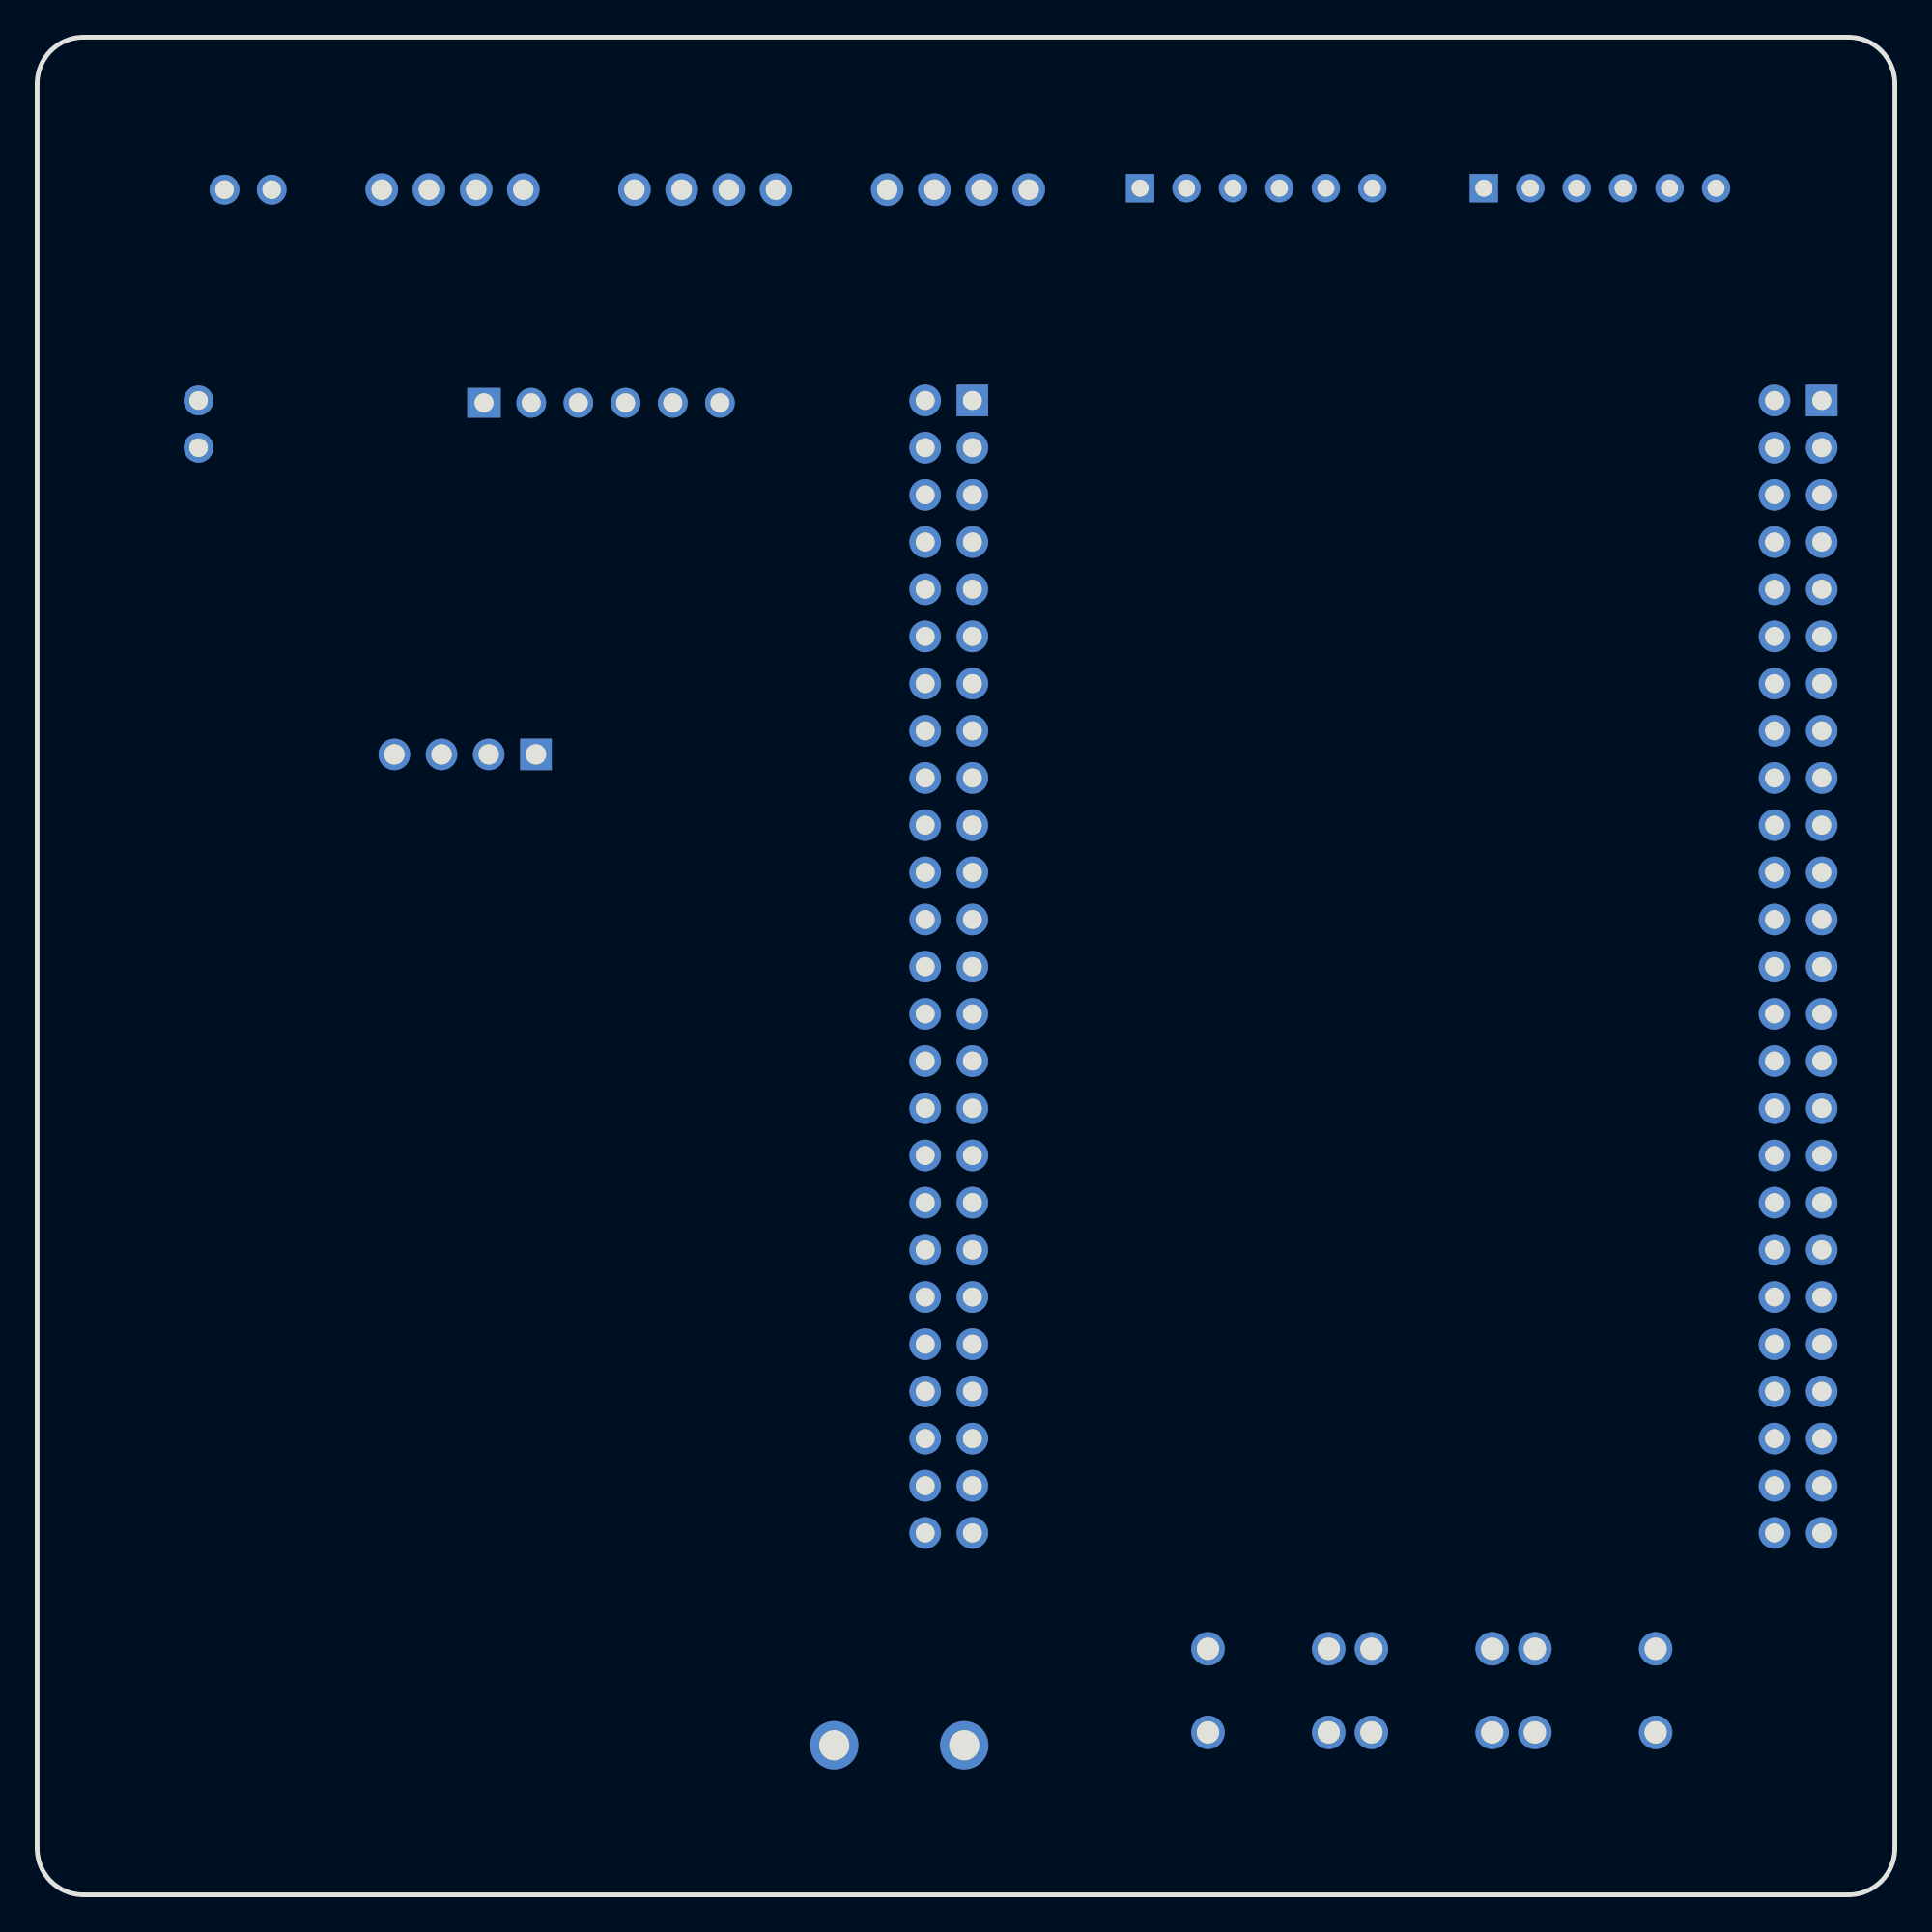
[diagram p4: board, bottom side, seen from below]

Outline 100 x 100 mm; copper layers: Top Layer, Bottom Layer. Coordinates in mm from the lower left corner of the outline.
Outline path: 0,97.5 0,2.5 arc(0.73,0.73) 2.5,0 97.5,0 arc(99.27,0.73) 100,2.5 100,97.5 arc(99.27,99.27) 97.5,100 2.5,100 arc(0.73,99.27) 0,97.5
Stack: Top Layer 0.035mm / Dielectric1 1.51mm FR4 er 4.5 / Bottom Layer 0.035mm

## Design rules (mm)
template: JLCPCB Capability(Two Layers Board)
spacing copperThickness1oz (default): track to track 0.102, other pairs 0.152 to 0.3
spacing copperThickness2oz: track to track 0.203, other pairs 0.152 to 0.3
track width copperThickness1oz (default): min 0.127, default 0.254, max 2.54
track width copperThickness2oz: min 0.203, default 0.254, max 2.54
differential pair differentialPair (default): width min 0.127, default 0.254, max 2.54; gap min 0.152, default 0.152
via viaSize (default): diameter min 0.5, default 0.61, max 10; hole min 0.3, default 0.305, max 6.3

## Placement (name value [footprint] x y rotation side)
H1  FH-00077  [HDR-TH_50P-P2.54-V-F-R2-C25-S2.54-1]  5.21 49.96 270 top
H2  FH-00077  [HDR-TH_50P-P2.54-V-F-R2-C25-S2.54-1]  50.93 49.96 270 top
H3  PM254V-11-06-H85  [HDR-TH_6P-P2.54-V-F]  69.6 80.31 180 top
H4  PM254V-11-04-H85  [HDR-TH_4P-P2.54-V-F]  76.96 61.39 0 top
NOREF  -  [CONN-TH_XH-2AW_C2908611]  91.31 79.17 90 top
NOREF#2  -  [CONN-TH_XH-2AW_C2908611]  88.65 91.79 180 top
NOREF#3  -  [CONN-TH_6P-P2.50_HC-XH-6AW-G]  15.88 91.87 180 top
NOREF#4  -  [CONN-TH_6P-P2.50_HC-XH-6AW-G]  34.38 91.87 180 top
NOREF#5  -  [CONN-TH_XH-4AW]  77.64 91.79 180 top
NOREF#6  -  [CONN-TH_XH-4AW]  50.43 91.79 180 top
NOREF#7  -  [CONN-TH_XH-4AW]  64.04 91.79 180 top
SW1  启动开关  [SW-TH_RS601A-1010015BB]  53.59 8.05 0 top
SW2  红色  [SW-TH_4P-L6.0-W6.0-P4.50-LS6.5]  16.13 11 0 top
SW3  绿色  [SW-TH_4P-L6.0-W6.0-P4.50-LS6.5]  24.93 11 0 top
SW4  蓝色  [SW-TH_4P-L6.0-W6.0-P4.50-LS6.5]  33.73 11 0 top

## Footprints (pads in the part's own frame, mm; a bottom-side part is the same pattern mirrored in y, then rotated)
CONN-TH_6P-P2.50_HC-XH-6AW-G
  rect 1.524x1.524 hole 0.914: 1(-6.25,0)
  round 1.524 hole 0.914: 2(-3.75,0) 3(-1.25,0) 4(1.25,0) 5(3.75,0) 6(6.25,0)
CONN-TH_XH-2AW_C2908611
  round 1.6 hole 1: 1(-1.27,0) 2(1.27,0)
CONN-TH_XH-4AW
  round 1.75 hole 1.1: 1(-3.81,0) 2(-1.27,0) 3(1.27,0) 4(3.81,0)
HDR-TH_4P-P2.54-V-F
  rect 1.7x1.7 hole 1.1: 1(-3.81,0)
  round 1.7 hole 1.1: 2(-1.27,0) 3(1.27,0) 4(3.81,0)
HDR-TH_6P-P2.54-V-F
  rect 1.8x1.6 hole 1.02: 1(-6.35,0)
  round 1.6 hole 1.02: 2(-3.81,0) 3(-1.27,0) 4(1.27,0) 5(3.81,0) 6(6.35,0)
HDR-TH_50P-P2.54-V-F-R2-C25-S2.54-1
  rect 1.7x1.7 hole 1.02: 1(-30.48,-1.27)
  round 1.7 hole 1.02: 2(-30.48,1.27) 3(-27.94,-1.27) 4(-27.94,1.27) 5(-25.4,-1.27) 6(-25.4,1.27) 7(-22.86,-1.27) 8(-22.86,1.27) 9(-20.32,-1.27) 10(-20.32,1.27) 11(-17.78,-1.27) 12(-17.78,1.27) 13(-15.24,-1.27) 14(-15.24,1.27) 15(-12.7,-1.27) 16(-12.7,1.27) 17(-10.16,-1.27) 18(-10.16,1.27) 19(-7.62,-1.27) 20(-7.62,1.27) 21(-5.08,-1.27) 22(-5.08,1.27) 23(-2.54,-1.27) 24(-2.54,1.27) 25(0,-1.27) 26(0,1.27) 27(2.54,-1.27) 28(2.54,1.27) 29(5.08,-1.27) 30(5.08,1.27) 31(7.62,-1.27) 32(7.62,1.27) 33(10.16,-1.27) 34(10.16,1.27) 35(12.7,-1.27) 36(12.7,1.27) 37(15.24,-1.27) 38(15.24,1.27) 39(17.78,-1.27) 40(17.78,1.27) 41(20.32,-1.27) 42(20.32,1.27) 43(22.86,-1.27) 44(22.86,1.27) 45(25.4,-1.27) 46(25.4,1.27) 47(27.94,-1.27) 48(27.94,1.27) 49(30.48,-1.27) 50(30.48,1.27)
SW-TH_4P-L6.0-W6.0-P4.50-LS6.5
  round 1.8 hole 1.2: 1(-3.25,2.25) 2(3.25,2.25) 3(-3.25,-2.25) 4(3.25,-2.25)
SW-TH_RS601A-1010015BB
  round 2.6 hole 1.62: 1(-3.5,0) 2(3.5,0)

## Nets
As in the schematic, except:
3.3V: H2.47 H2.49 H3.2 NOREF#2.1
3.3V1: H4.2 NOREF.1
GND: H1.47 H1.49 H2.50 H3.5 H4.1 NOREF.2 NOREF#2.2 NOREF#5.3

Pads without a net: SW1 1 2; SW2 1 2 3 4; SW3 1 2 3 4; SW4 1 2 3 4

## Text on the board
Top Silkscreen Layer: BIN22 | BIN21 | PWM2 | AIN11 | AIN12 | PWM1 | BIN42 | BIN41 | PWM4 | AIN31 | AIN32 | PWM3 | B22 | B21 | B12 | B11 | B42 | B41 | B32 | B31 | GND | TXD | RXD | 3.3V | 3.3V1

# Board driver
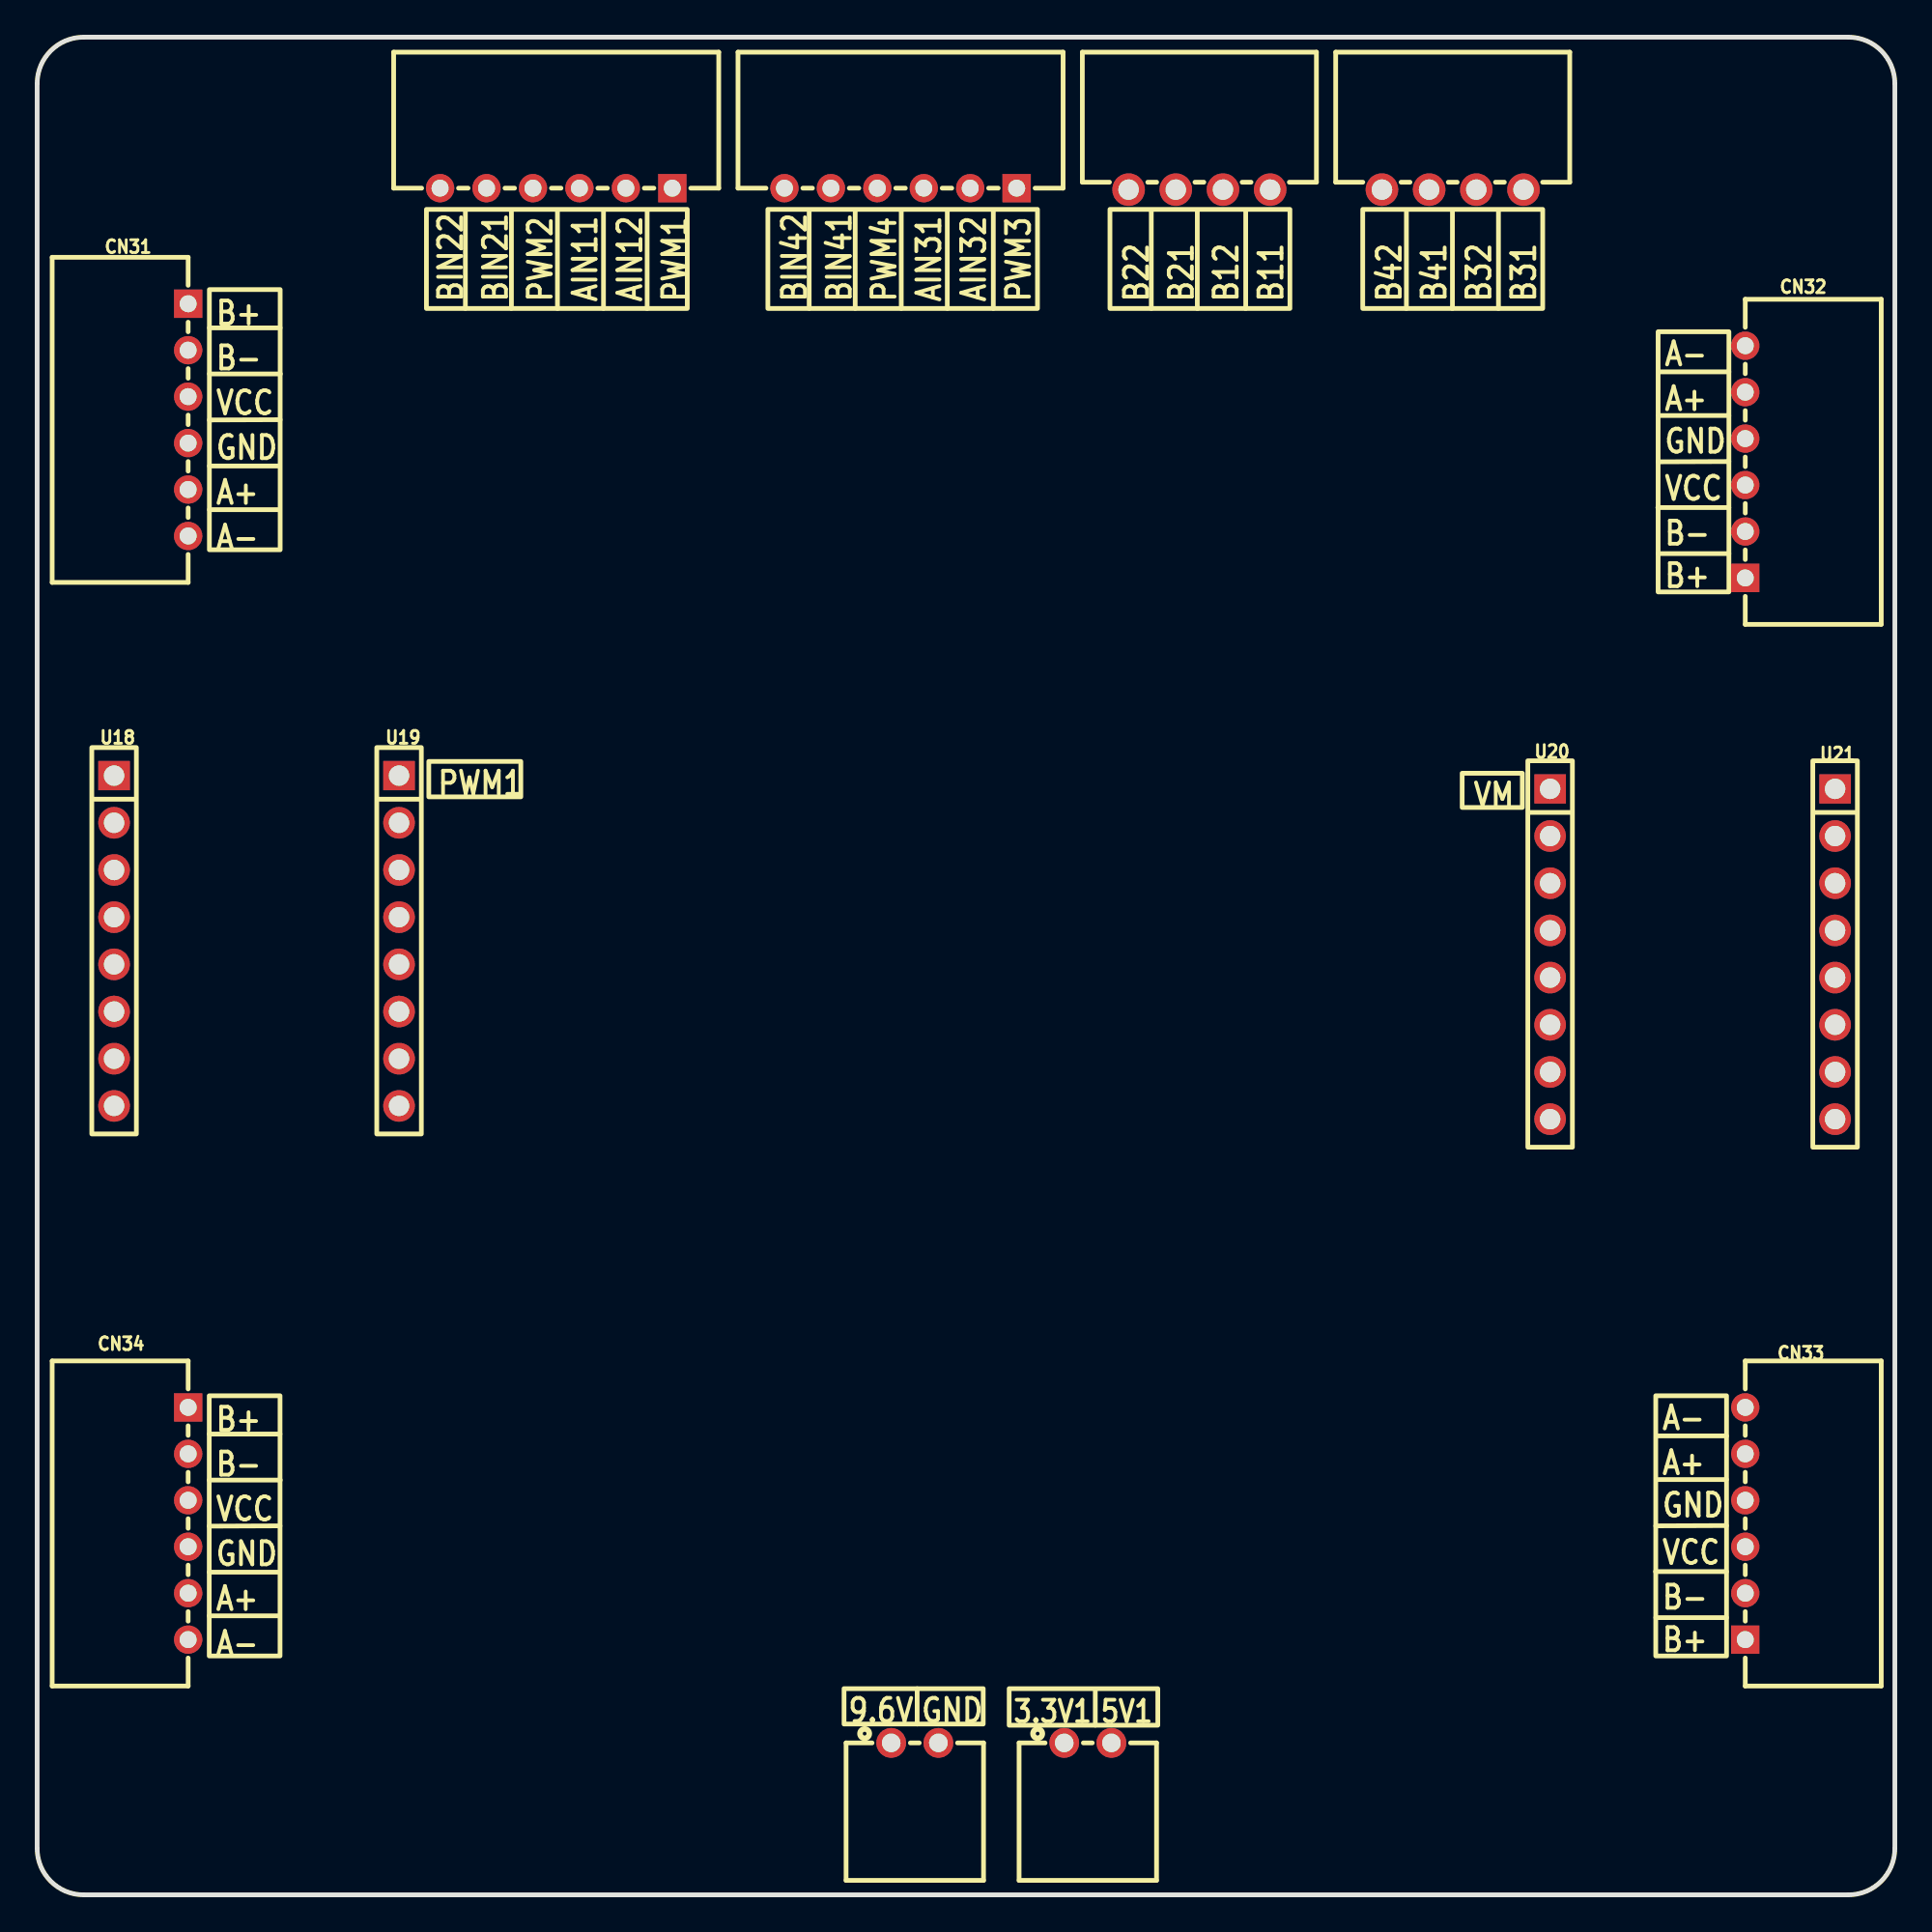
[diagram p5: board, top side]
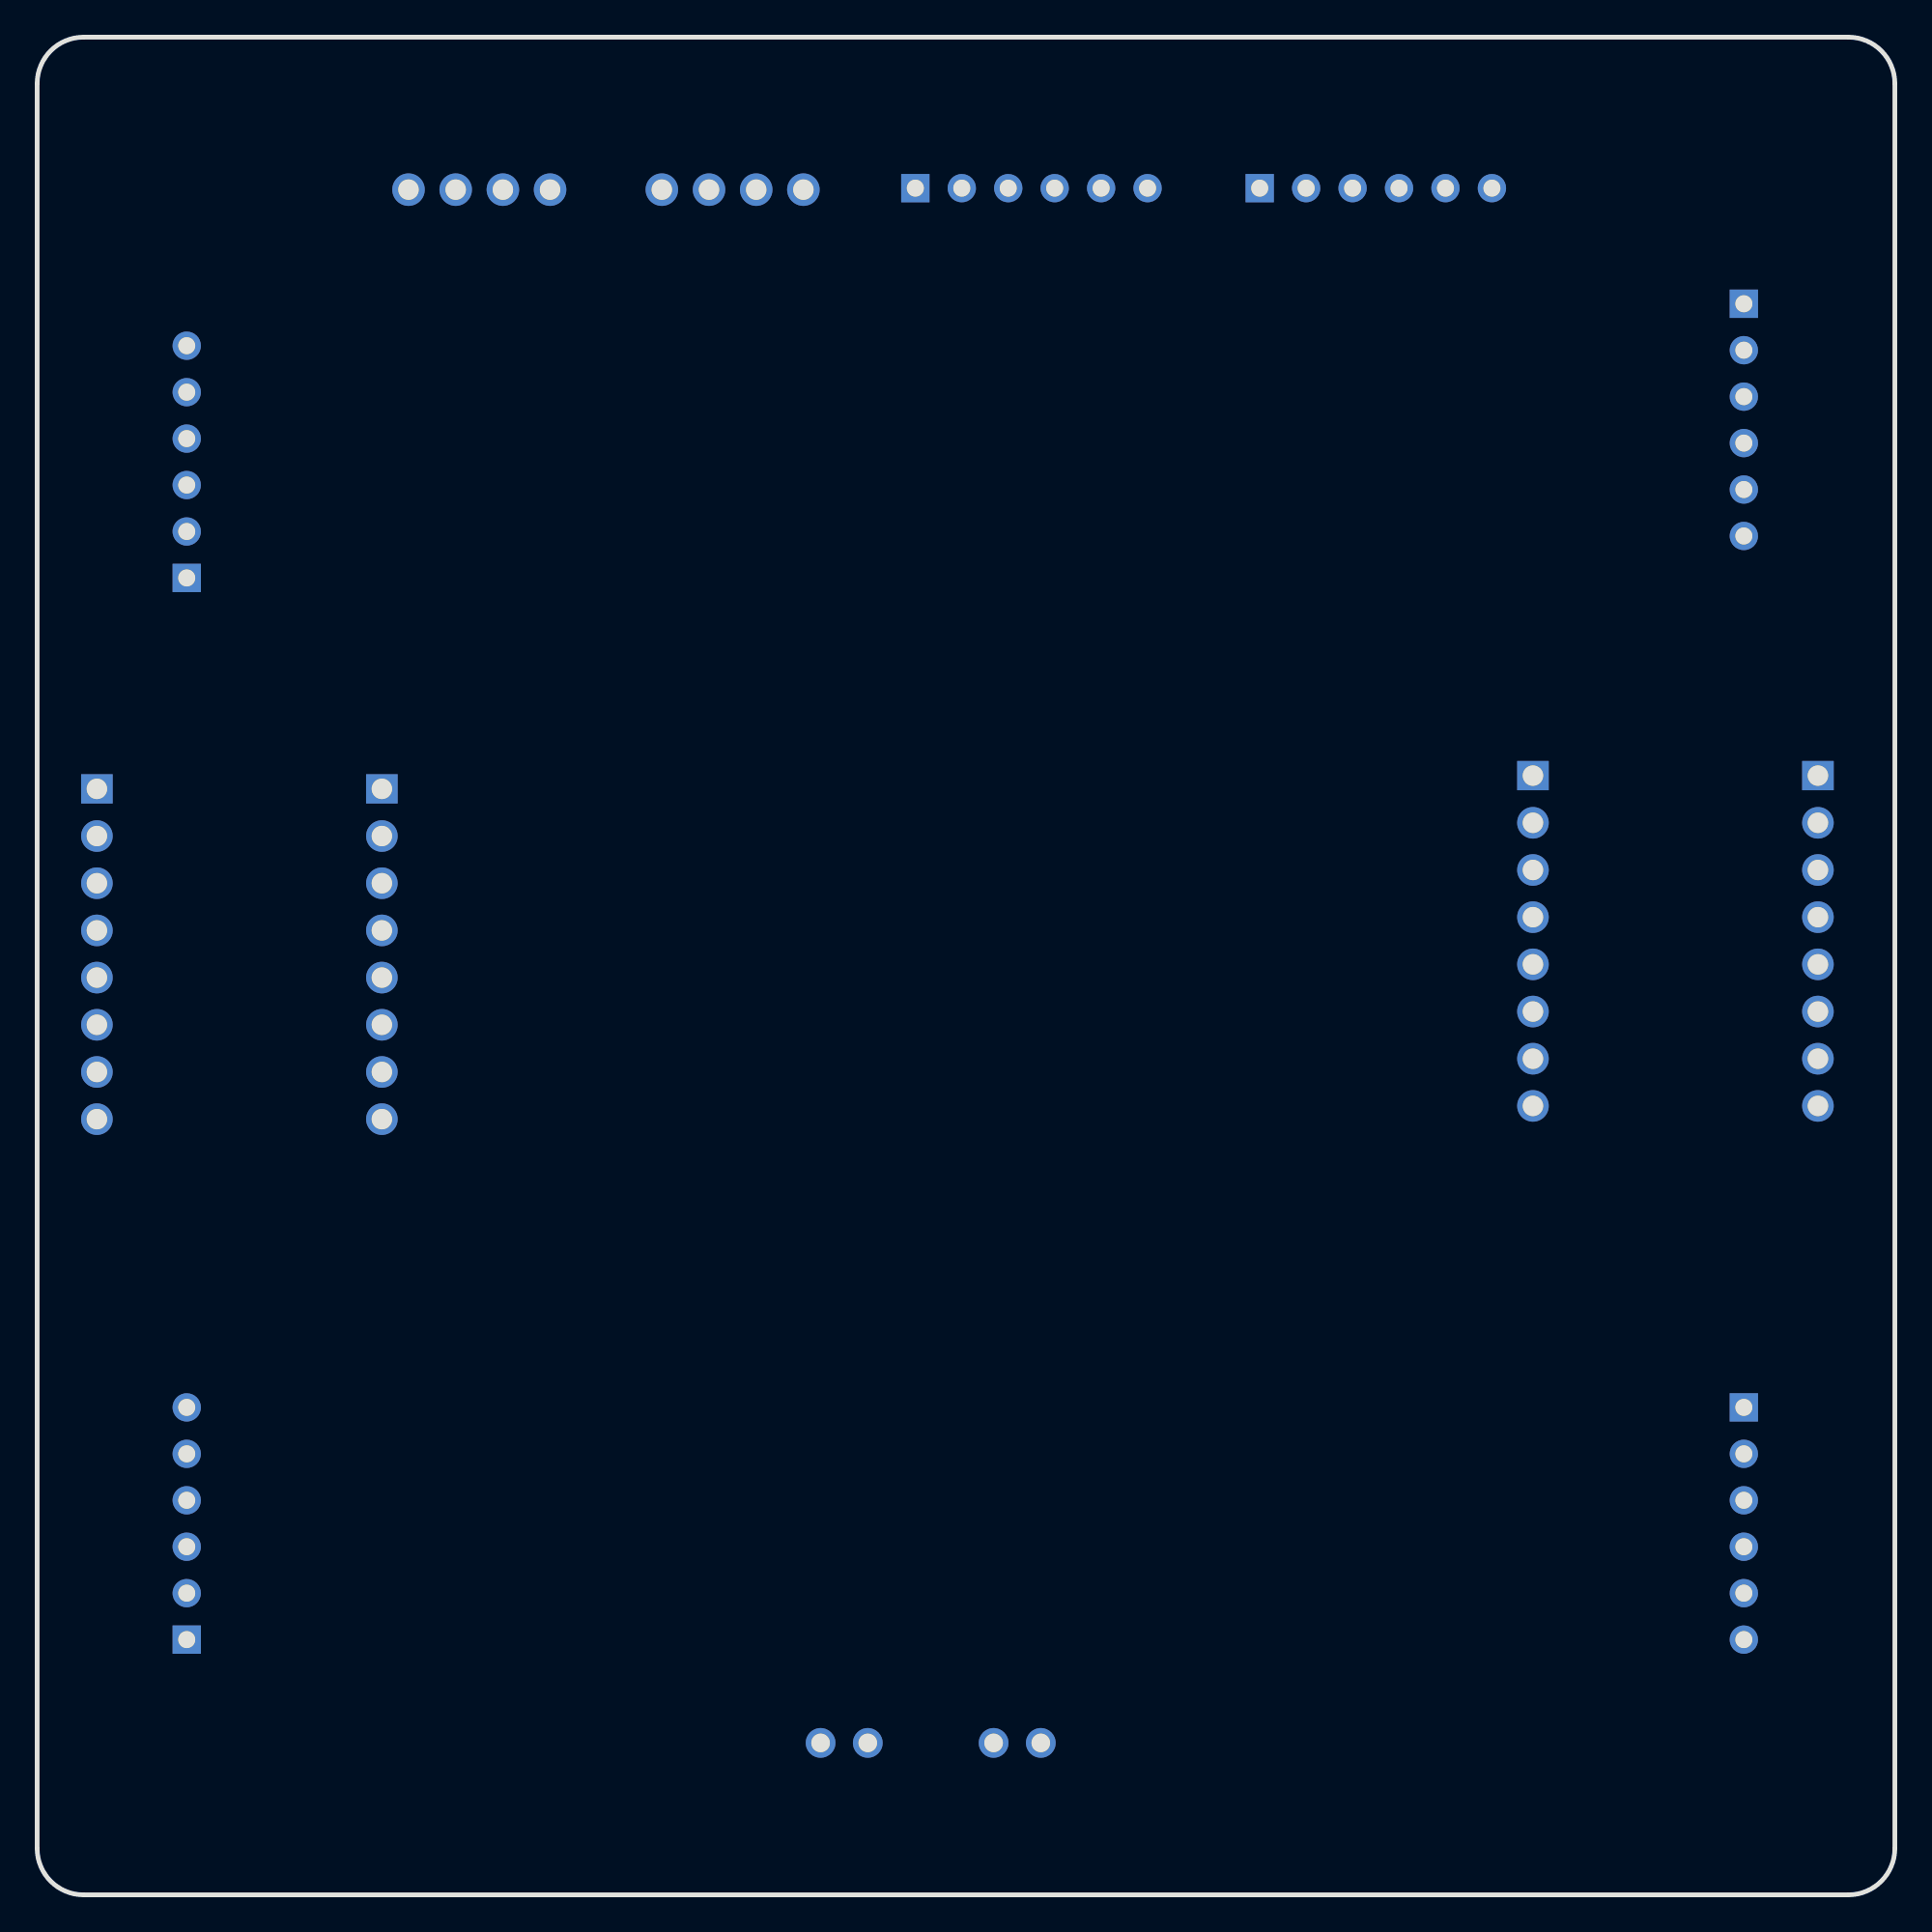
[diagram p6: board, bottom side, seen from below]

Outline 100 x 100 mm; copper layers: Top Layer, Bottom Layer. Coordinates in mm from the lower left corner of the outline.
Outline path: 0,97.5 0,2.5 arc(0.73,0.73) 2.5,0 97.5,0 arc(99.27,0.73) 100,2.5 100,97.5 arc(99.27,99.27) 97.5,100 2.5,100 arc(0.73,99.27) 0,97.5
Stack: Top Layer 0.035mm / Dielectric1 1.51mm FR4 er 4.5 / Bottom Layer 0.035mm

## Design rules (mm)
template: JLCPCB Capability(Two Layers Board)
spacing copperThickness1oz (default): track to track 0.102, other pairs 0.152 to 0.3
spacing copperThickness2oz: track to track 0.203, other pairs 0.152 to 0.3
track width copperThickness1oz (default): min 0.127, default 0.254, max 2.54
track width copperThickness2oz: min 0.203, default 0.254, max 2.54
differential pair differentialPair (default): width min 0.127, default 0.254, max 2.54; gap min 0.152, default 0.152
via viaSize (default): diameter min 0.5, default 0.61, max 10; hole min 0.3, default 0.305, max 6.3

## Placement (name value [footprint] x y rotation side)
CN31  电机1  [CONN-TH_6P-P2.50_HC-XH-6AW-G]  8.13 79.4 270 top
CN32  电机2  [CONN-TH_6P-P2.50_HC-XH-6AW-G]  91.95 77.14 90 top
CN33  电机3  [CONN-TH_6P-P2.50_HC-XH-6AW-G]  91.95 19.99 90 top
CN34  电机4  [CONN-TH_6P-P2.50_HC-XH-6AW-G]  8.13 19.99 270 top
NOREF  -  [CONN-TH_6P-P2.50_HC-XH-6AW-G]  27.94 91.87 180 top
NOREF#2  -  [CONN-TH_6P-P2.50_HC-XH-6AW-G]  46.48 91.87 180 top
NOREF#3  -  [CONN-TH_XH-4AW]  62.56 91.79 180 top
NOREF#4  -  [CONN-TH_XH-4AW]  76.2 91.79 180 top
NOREF#5  -  [CONN-TH_XH-2AW_C2908611]  47.24 8.18 0 top
NOREF#6  -  [CONN-TH_XH-2AW_C2908611]  56.56 8.18 0 top
U18  TB6612 1  [HDR-TH_8P-P2.54-V-F]  4.14 51.36 270 top
U19  TB6612 1  [HDR-TH_8P-P2.54-V-F]  19.48 51.36 270 top
U20  TB6612 2  [HDR-TH_8P-P2.54-V-F]  81.44 50.65 270 top
U21  TB6612 2  [HDR-TH_8P-P2.54-V-F]  96.78 50.65 270 top

## Footprints (pads in the part's own frame, mm; a bottom-side part is the same pattern mirrored in y, then rotated)
CONN-TH_6P-P2.50_HC-XH-6AW-G
  rect 1.524x1.524 hole 0.914: 1(-6.25,0)
  round 1.524 hole 0.914: 2(-3.75,0) 3(-1.25,0) 4(1.25,0) 5(3.75,0) 6(6.25,0)
CONN-TH_XH-2AW_C2908611
  round 1.6 hole 1: 1(-1.27,0) 2(1.27,0)
CONN-TH_XH-4AW
  round 1.75 hole 1.1: 1(-3.81,0) 2(-1.27,0) 3(1.27,0) 4(3.81,0)
HDR-TH_8P-P2.54-V-F
  rect 1.575x1.7 hole 1.1: 1(-8.89,0)
  round 1.7 hole 1.1: 2(-6.35,0) 3(-3.81,0) 4(-1.27,0) 5(1.27,0) 6(3.81,0) 7(6.35,0) 8(8.89,0)

## Nets
3.3V1: NOREF#6.1 U18.2 U19.4 U20.2 U21.4
5V1: CN31.3 CN32.3 CN33.3 CN34.3 NOREF#6.2
9.6V: NOREF#5.1 U18.1 U20.1
GND: CN31.4 CN32.4 CN33.4 CN34.4 NOREF#5.2 U18.3 U18.8 U19.8 U20.3 U20.8 U21.8
AIN11: NOREF.3 U19.3
AIN12: NOREF.2 U19.2
AIN31: NOREF#2.3 U21.3
AIN32: NOREF#2.2 U21.2
AO11: CN31.5 U18.4
AO12: CN31.6 U18.5
AO31: CN33.5 U20.4
AO32: CN33.6 U20.5
B11: CN31.1 NOREF#3.1
B12: CN31.2 NOREF#3.2
B21: CN32.1 NOREF#3.3
B22: CN32.2 NOREF#3.4
B31: CN33.1 NOREF#4.1
B32: CN33.2 NOREF#4.2
B41: CN34.1 NOREF#4.3
B42: CN34.2 NOREF#4.4
BIN21: NOREF.5 U19.5
BIN22: NOREF.6 U19.6
BIN41: NOREF#2.5 U21.5
BIN42: NOREF#2.6 U21.6
BO21: CN32.5 U18.7
BO22: CN32.6 U18.6
BO41: CN34.5 U20.7
BO42: CN34.6 U20.6
PWM1: NOREF.1 U19.1
PWM2: NOREF.4 U19.7
PWM3: NOREF#2.1 U21.1
PWM4: NOREF#2.4 U21.7

## Text on the board
Top Silkscreen Layer: 3.3V1 | 5V1 | PWM1 | 9.6V | GND | VM | BIN22 | BIN21 | PWM2 | AIN11 | AIN12 | BIN42 | BIN41 | PWM4 | AIN31 | AIN32 | PWM3 | B22 | B21 | B12 | B11 | B42 | B41 | B32 | B31 | B+ | B- | VCC | A+ | A-

# Board power
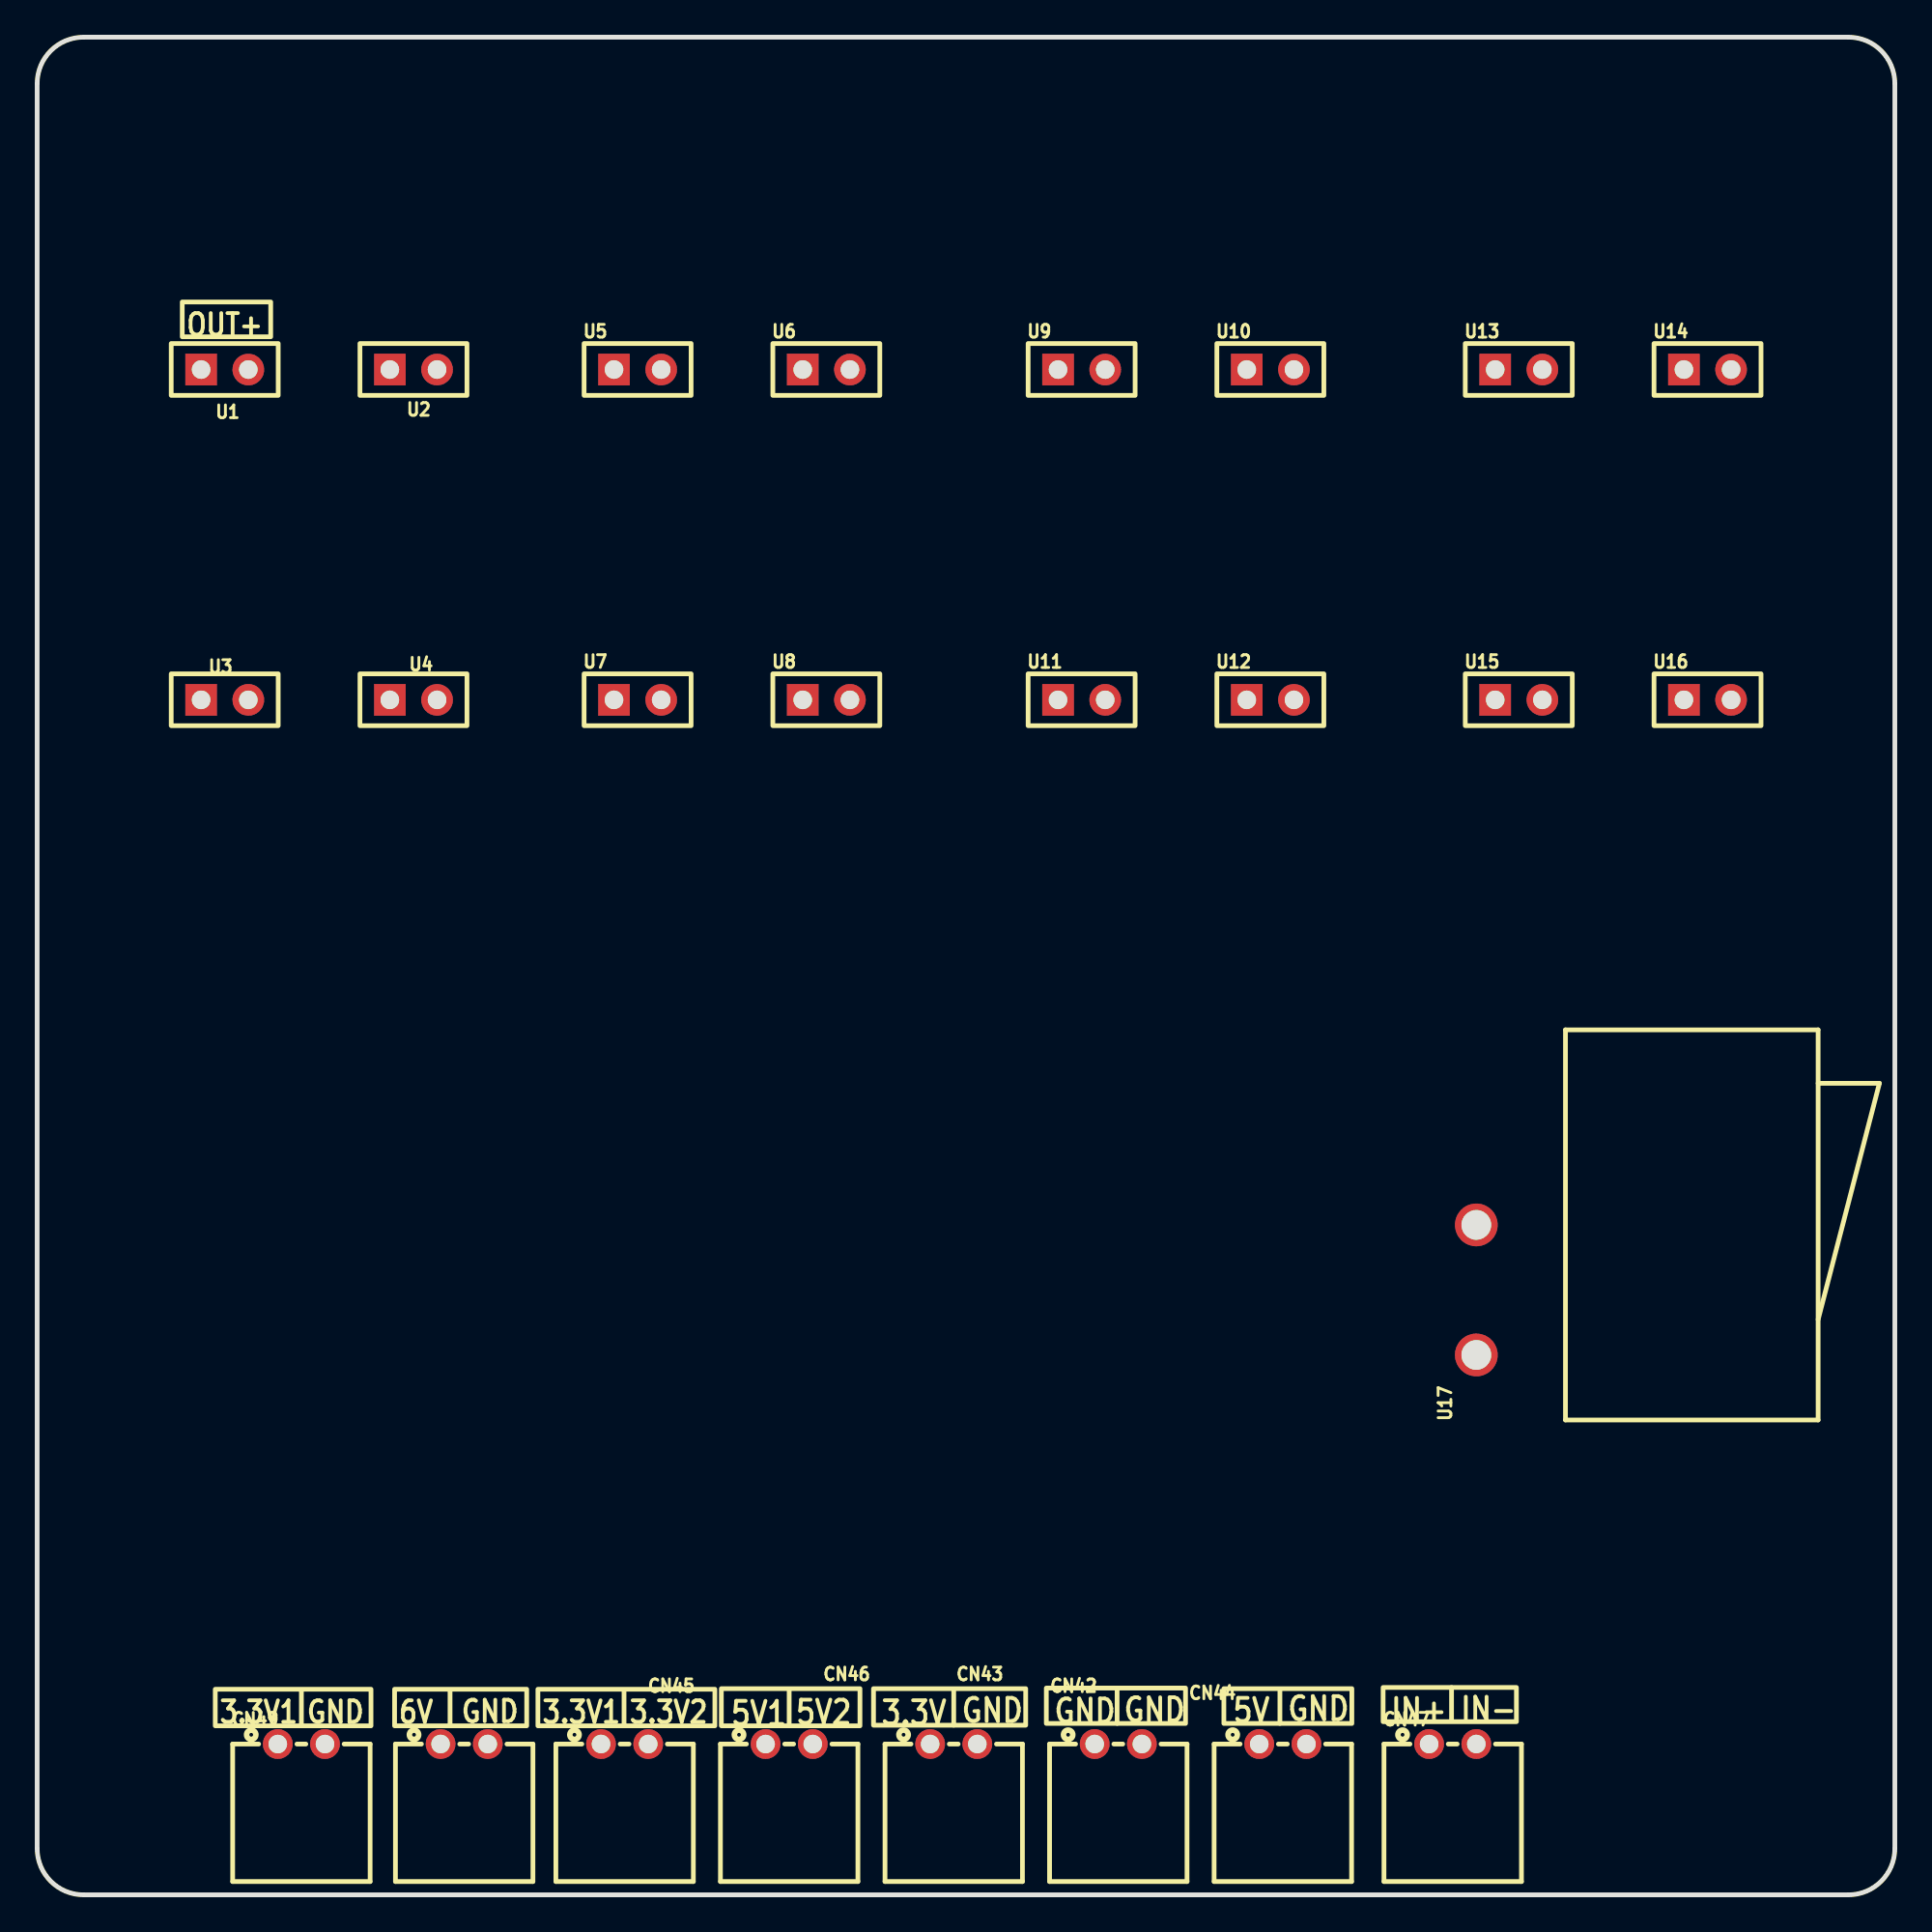
[diagram p7: board, top side]
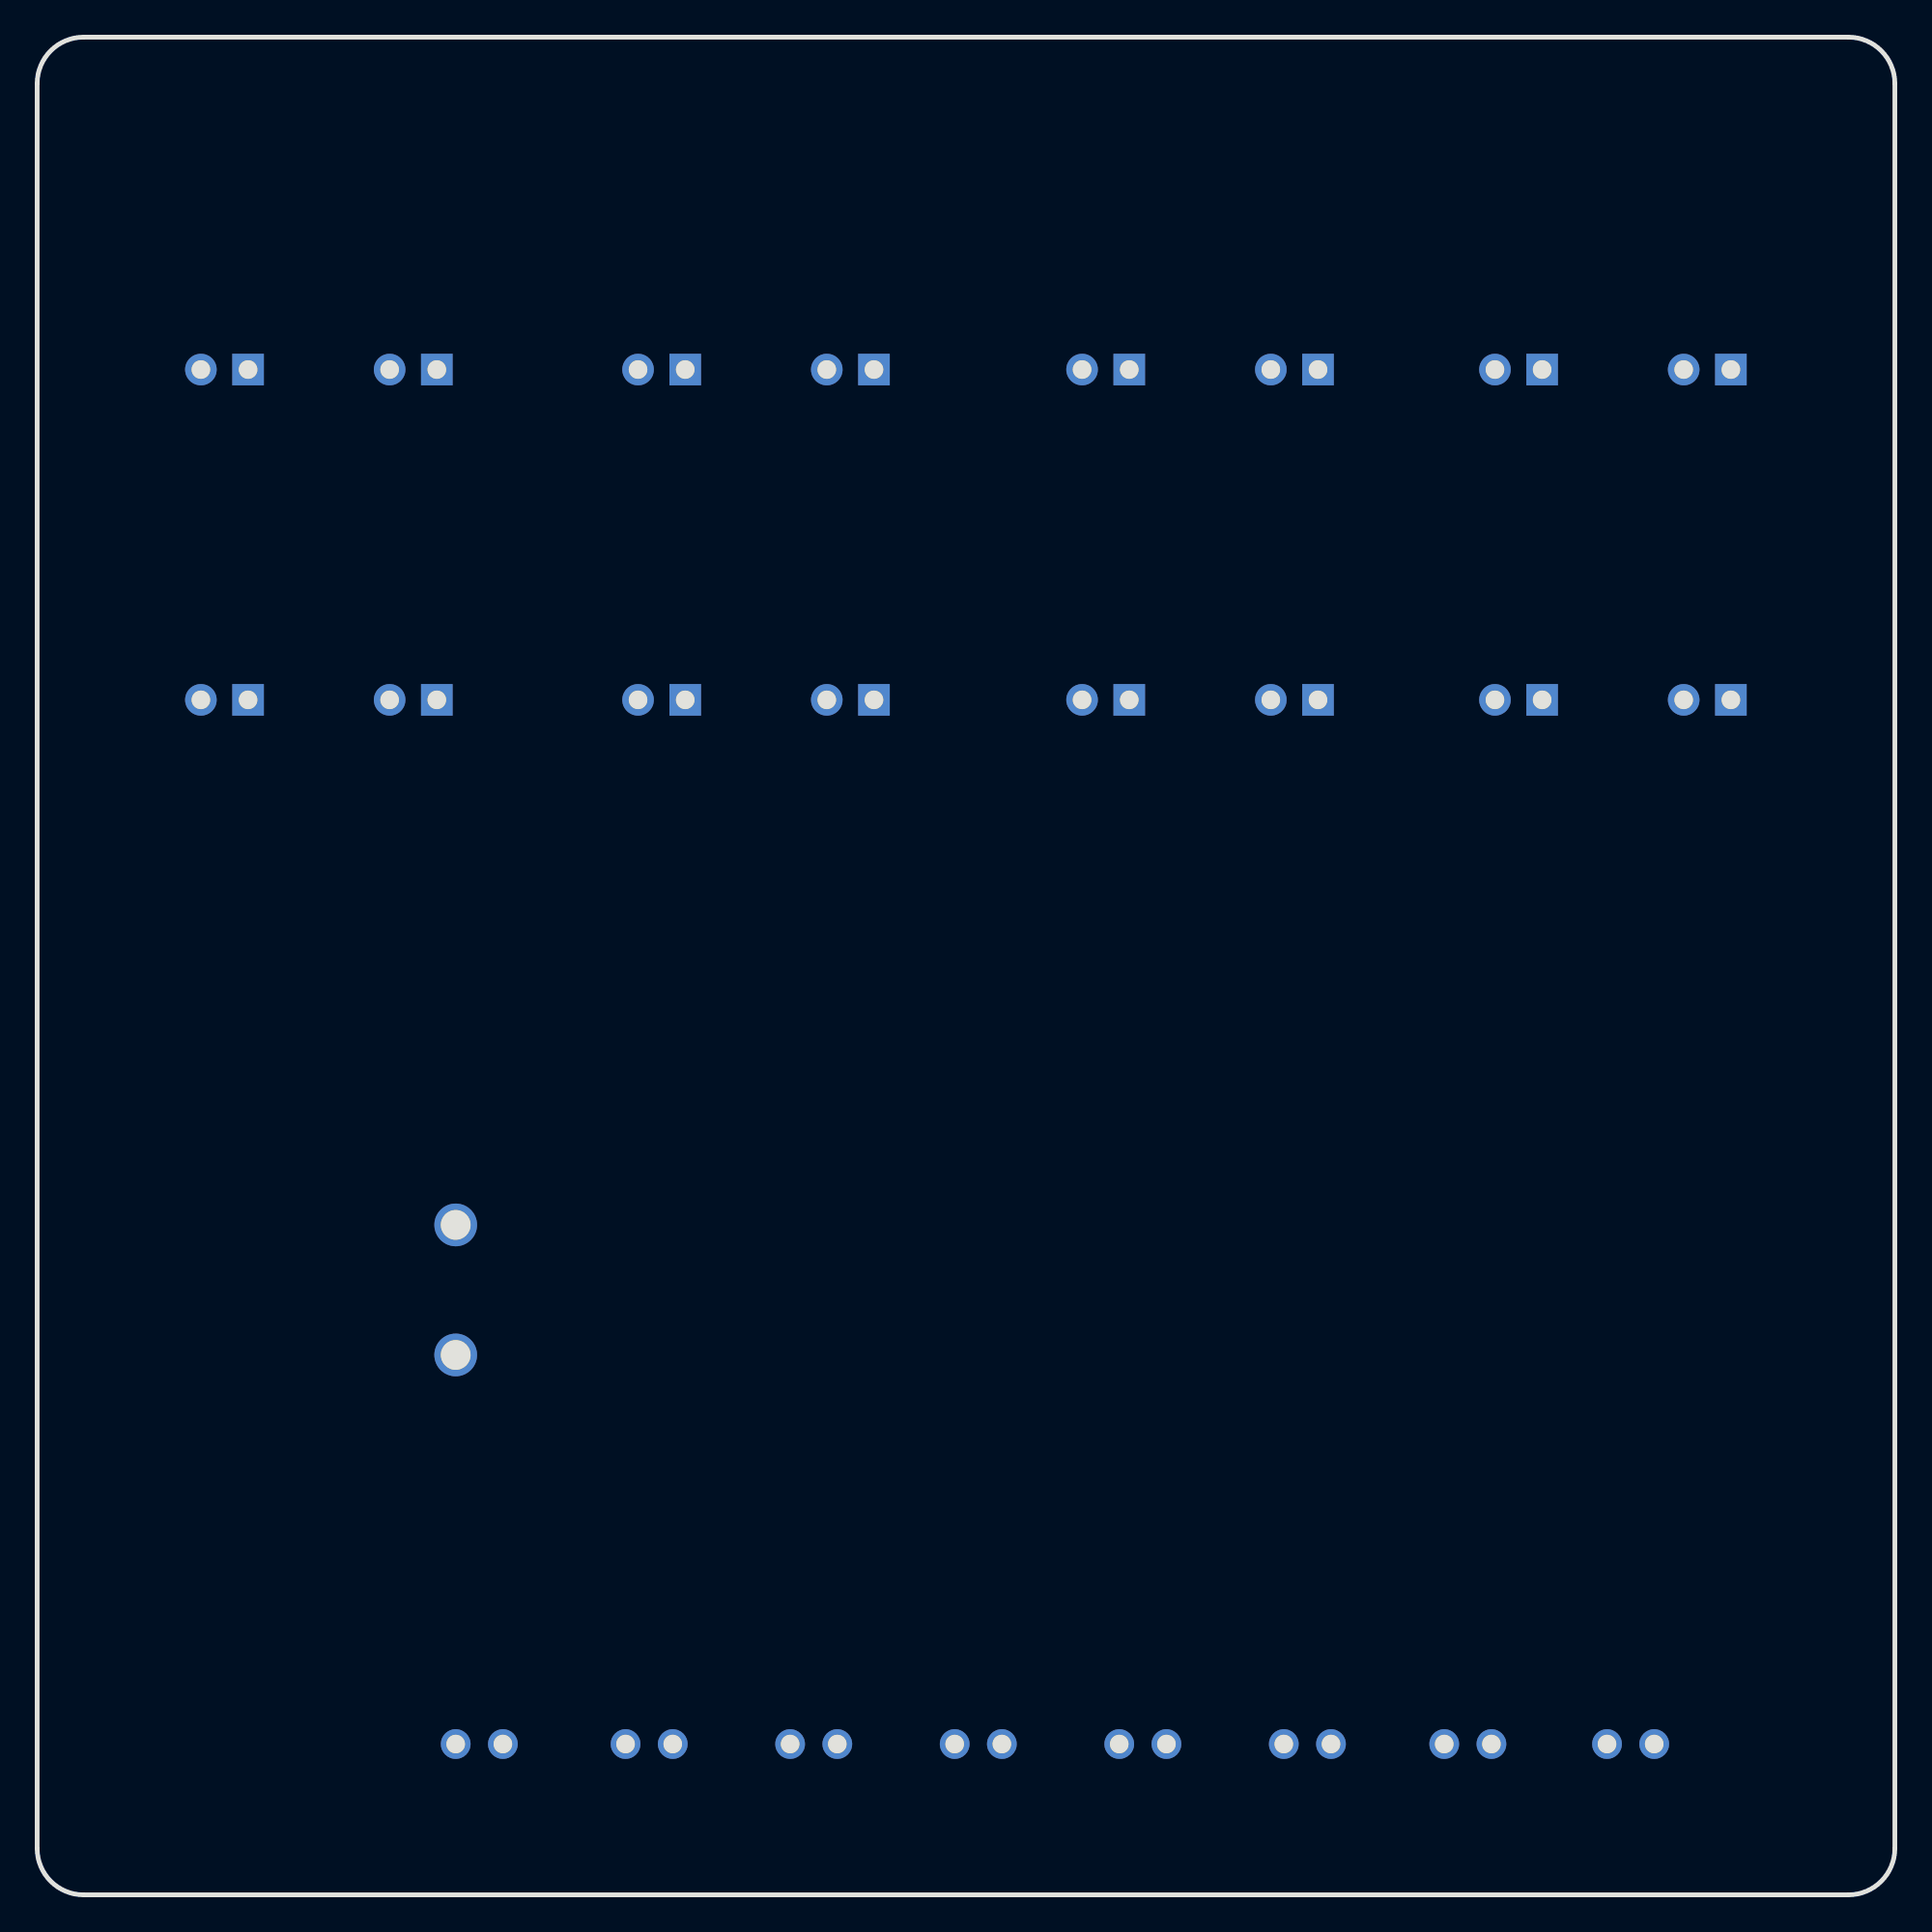
[diagram p8: board, bottom side, seen from below]

Outline 100 x 100 mm; copper layers: Top Layer, Bottom Layer. Coordinates in mm from the lower left corner of the outline.
Outline path: 0,97.5 0,2.5 arc(0.73,0.73) 2.5,0 97.5,0 arc(99.27,0.73) 100,2.5 100,97.5 arc(99.27,99.27) 97.5,100 2.5,100 arc(0.73,99.27) 0,97.5
Stack: Top Layer 0.035mm / Dielectric1 1.51mm FR4 er 4.5 / Bottom Layer 0.035mm

## Design rules (mm)
template: JLCPCB Capability(Two Layers Board)
spacing copperThickness1oz (default): track to track 0.102, other pairs 0.152 to 0.3
spacing copperThickness2oz: track to track 0.203, other pairs 0.152 to 0.3
track width copperThickness1oz (default): min 0.127, default 0.254, max 2.54
track width copperThickness2oz: min 0.203, default 0.254, max 2.54
differential pair differentialPair (default): width min 0.127, default 0.254, max 2.54; gap min 0.152, default 0.152
via viaSize (default): diameter min 0.5, default 0.61, max 10; hole min 0.3, default 0.305, max 6.3

## Placement (name value [footprint] x y rotation side)
CN42  XH-2AW  [CONN-TH_XH-2AW_C2908611]  58.2 8.12 0 top
CN43  MASTER  [CONN-TH_XH-2AW_C2908611]  49.34 8.12 0 top
CN44  OPENMV  [CONN-TH_XH-2AW_C2908611]  67.06 8.12 0 top
CN45  DRIVER  [CONN-TH_XH-2AW_C2908611]  31.62 8.12 0 top
CN46  DRIVER  [CONN-TH_XH-2AW_C2908611]  40.48 8.12 0 top
CN47  XH-2AW  [CONN-TH_XH-2AW_C2908611]  76.2 8.12 0 top
CN49  MASTER  [CONN-TH_XH-2AW_C2908611]  14.22 8.12 0 top
NOREF  -  [CONN-TH_XH-2AW_C2908611]  22.99 8.12 0 top
U1  PM254-1-02-Z-8.5  [HDR-TH_2P-P2.54-V-F]  10.1 82.11 0 top
U2  PM254-1-02-Z-8.5  [HDR-TH_2P-P2.54-V-F]  20.26 82.11 0 top
U3  PM254-1-02-Z-8.5  [HDR-TH_2P-P2.54-V-F]  10.1 64.33 0 top
U4  PM254-1-02-Z-8.5  [HDR-TH_2P-P2.54-V-F]  20.26 64.33 0 top
U5  PM254-1-02-Z-8.5  [HDR-TH_2P-P2.54-V-F]  32.32 82.11 0 top
U6  PM254-1-02-Z-8.5  [HDR-TH_2P-P2.54-V-F]  42.48 82.11 0 top
U7  PM254-1-02-Z-8.5  [HDR-TH_2P-P2.54-V-F]  32.32 64.33 0 top
U8  PM254-1-02-Z-8.5  [HDR-TH_2P-P2.54-V-F]  42.48 64.33 0 top
U9  PM254-1-02-Z-8.5  [HDR-TH_2P-P2.54-V-F]  56.22 82.11 0 top
U10  PM254-1-02-Z-8.5  [HDR-TH_2P-P2.54-V-F]  66.38 82.11 0 top
U11  PM254-1-02-Z-8.5  [HDR-TH_2P-P2.54-V-F]  56.22 64.33 0 top
U12  PM254-1-02-Z-8.5  [HDR-TH_2P-P2.54-V-F]  66.38 64.33 0 top
U13  PM254-1-02-Z-8.5  [HDR-TH_2P-P2.54-V-F]  79.76 82.11 0 top
U14  PM254-1-02-Z-8.5  [HDR-TH_2P-P2.54-V-F]  89.92 82.11 0 top
U15  PM254-1-02-Z-8.5  [HDR-TH_2P-P2.54-V-F]  79.76 64.33 0 top
U16  PM254-1-02-Z-8.5  [HDR-TH_2P-P2.54-V-F]  89.92 64.33 0 top
U17  电源开关  [SW-TH_RS601A-1010013BB]  77.47 32.56 90 top

## Footprints (pads in the part's own frame, mm; a bottom-side part is the same pattern mirrored in y, then rotated)
CONN-TH_XH-2AW_C2908611
  round 1.6 hole 1: 1(-1.27,0) 2(1.27,0)
HDR-TH_2P-P2.54-V-F
  rect 1.7x1.7 hole 1: 1(-1.27,0)
  round 1.7 hole 1: 2(1.27,0)
SW-TH_RS601A-1010013BB
  round 2.3 hole 1.6: 1(-3.5,0) 2(3.5,0)

## Nets
3.3V: CN43.1 U13.1 U13.2
3.3V1: CN45.1 CN49.1 U1.1 U1.2
5V: CN44.1 U5.2
5V1: CN45.2 U5.1
6V: NOREF.1 U9.1 U9.2
9.6V: CN42.1 CN46.1
GND: CN42.2 CN43.2 CN44.2 CN46.2 CN49.2 NOREF.2 U2.1 U2.2 U6.1 U6.2 U10.1 U10.2 U14.1 U14.2
IN+: CN47.1 U4.1 U4.2 U8.1 U8.2 U12.1 U12.2 U16.1 U16.2
IN-: CN47.2 U3.1 U3.2 U7.1 U7.2 U11.1 U11.2 U15.1 U15.2

Pads without a net: U17 1 2

## Text on the board
Top Silkscreen Layer: OUT+ | 3.3V1 | GND | 6V | 3.3V2 | 5V1 | 5V2 | 3.3V | 5V | IN+ | IN-
